# EasyEDA Pro project ProPrj_SCH_SnailCard底板_2025-01-03_23-10-43_2025-01-31.epro, board PCB_SnailCard 3底板
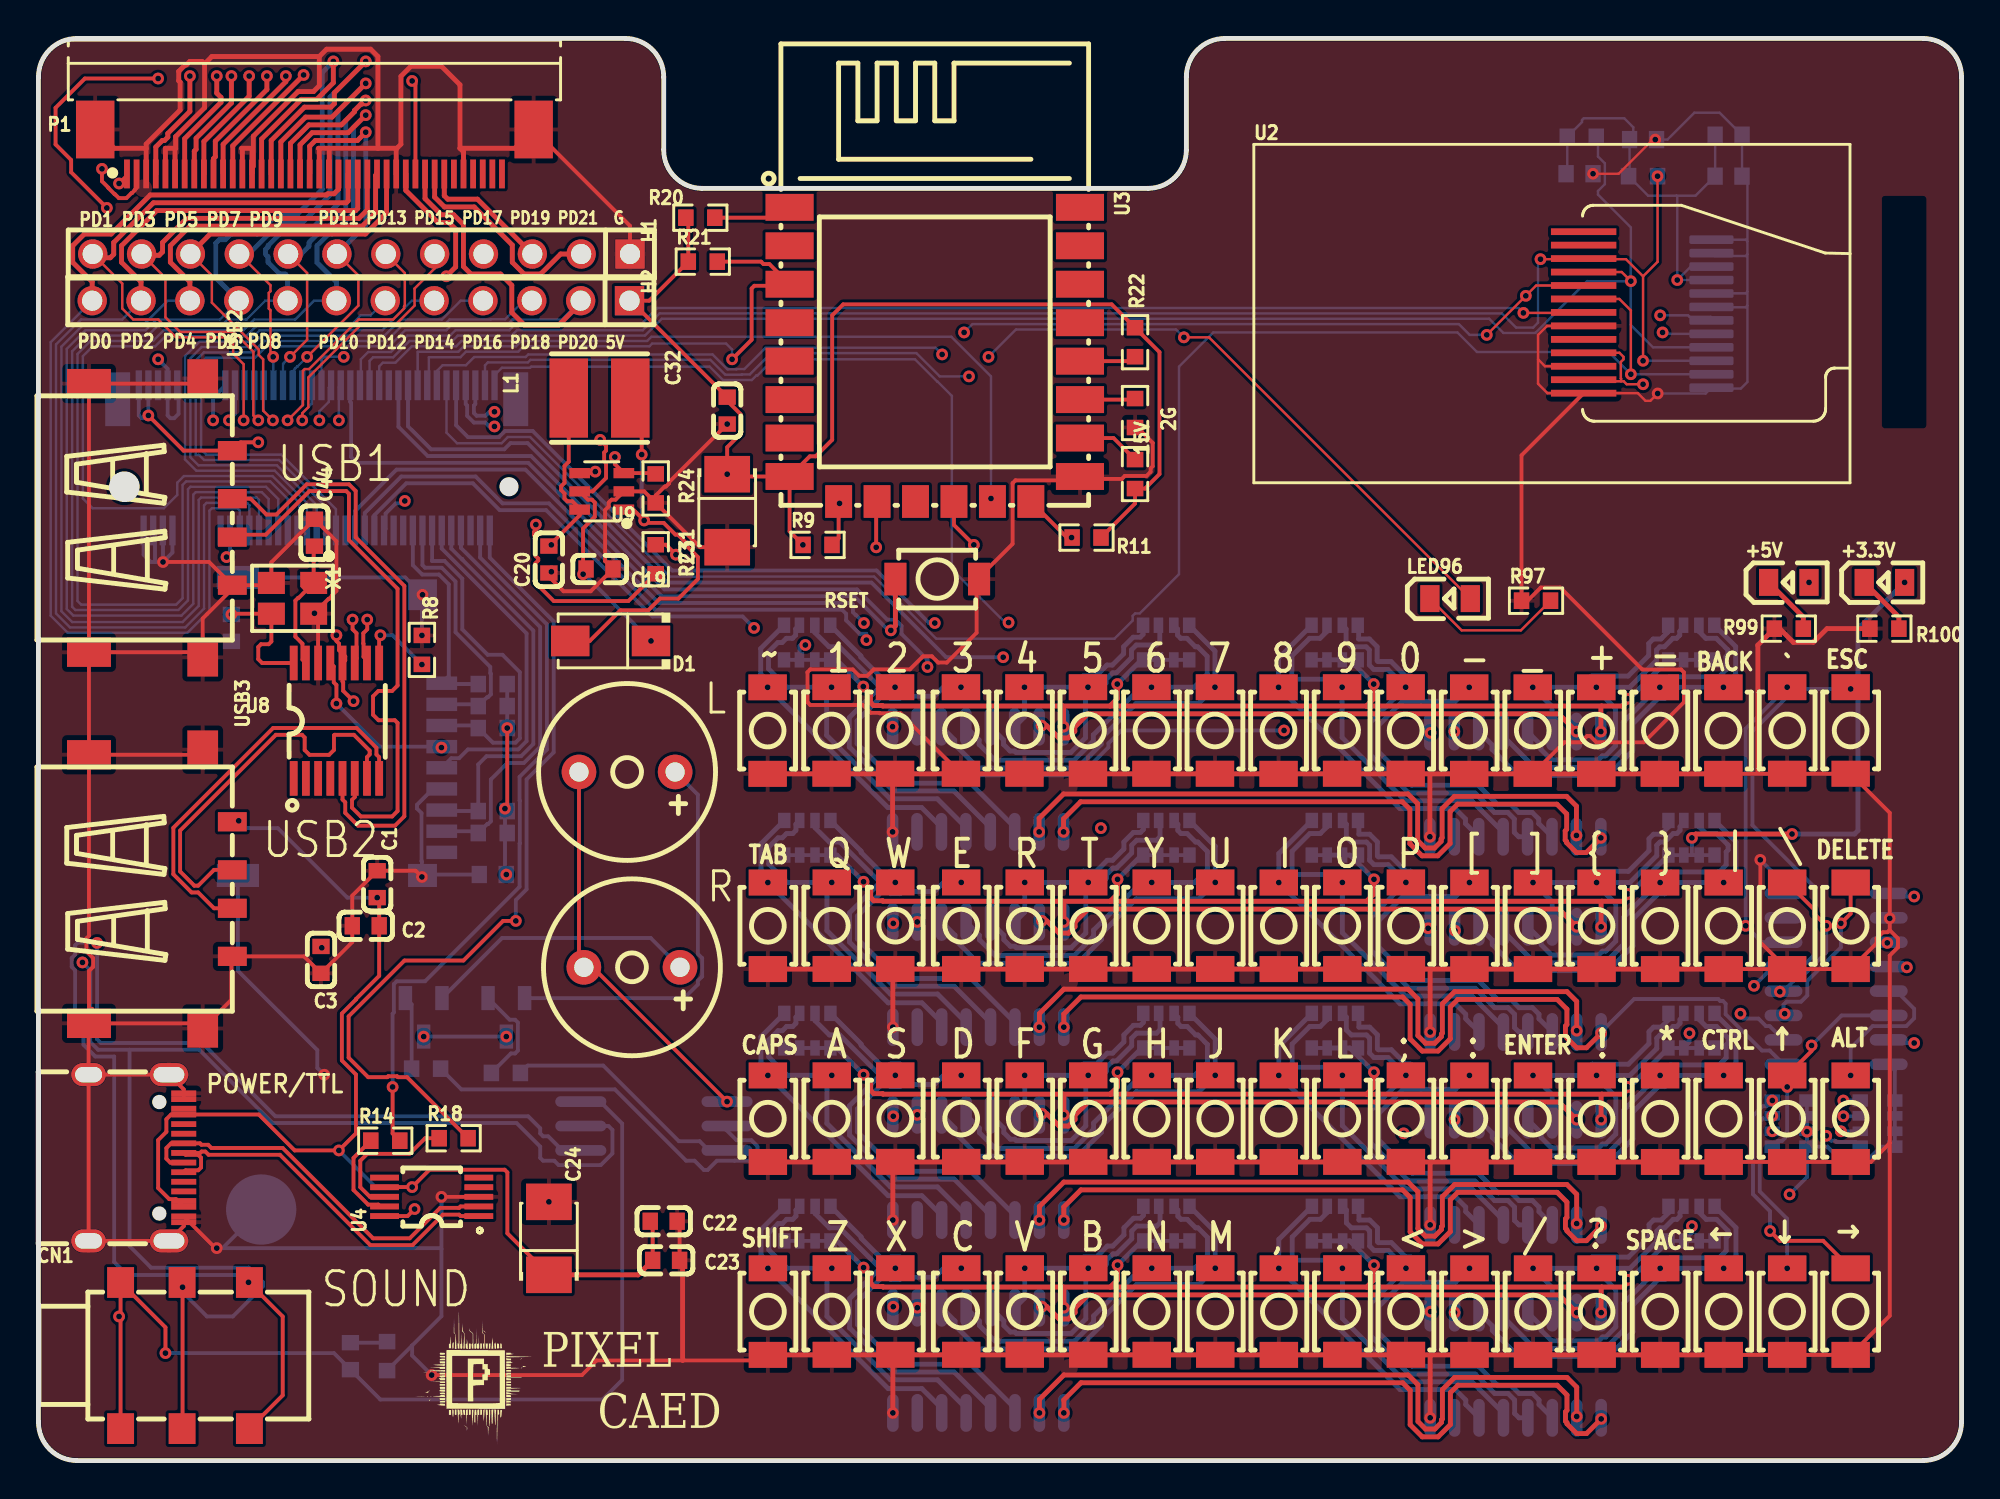
[diagram p1: board, top side]
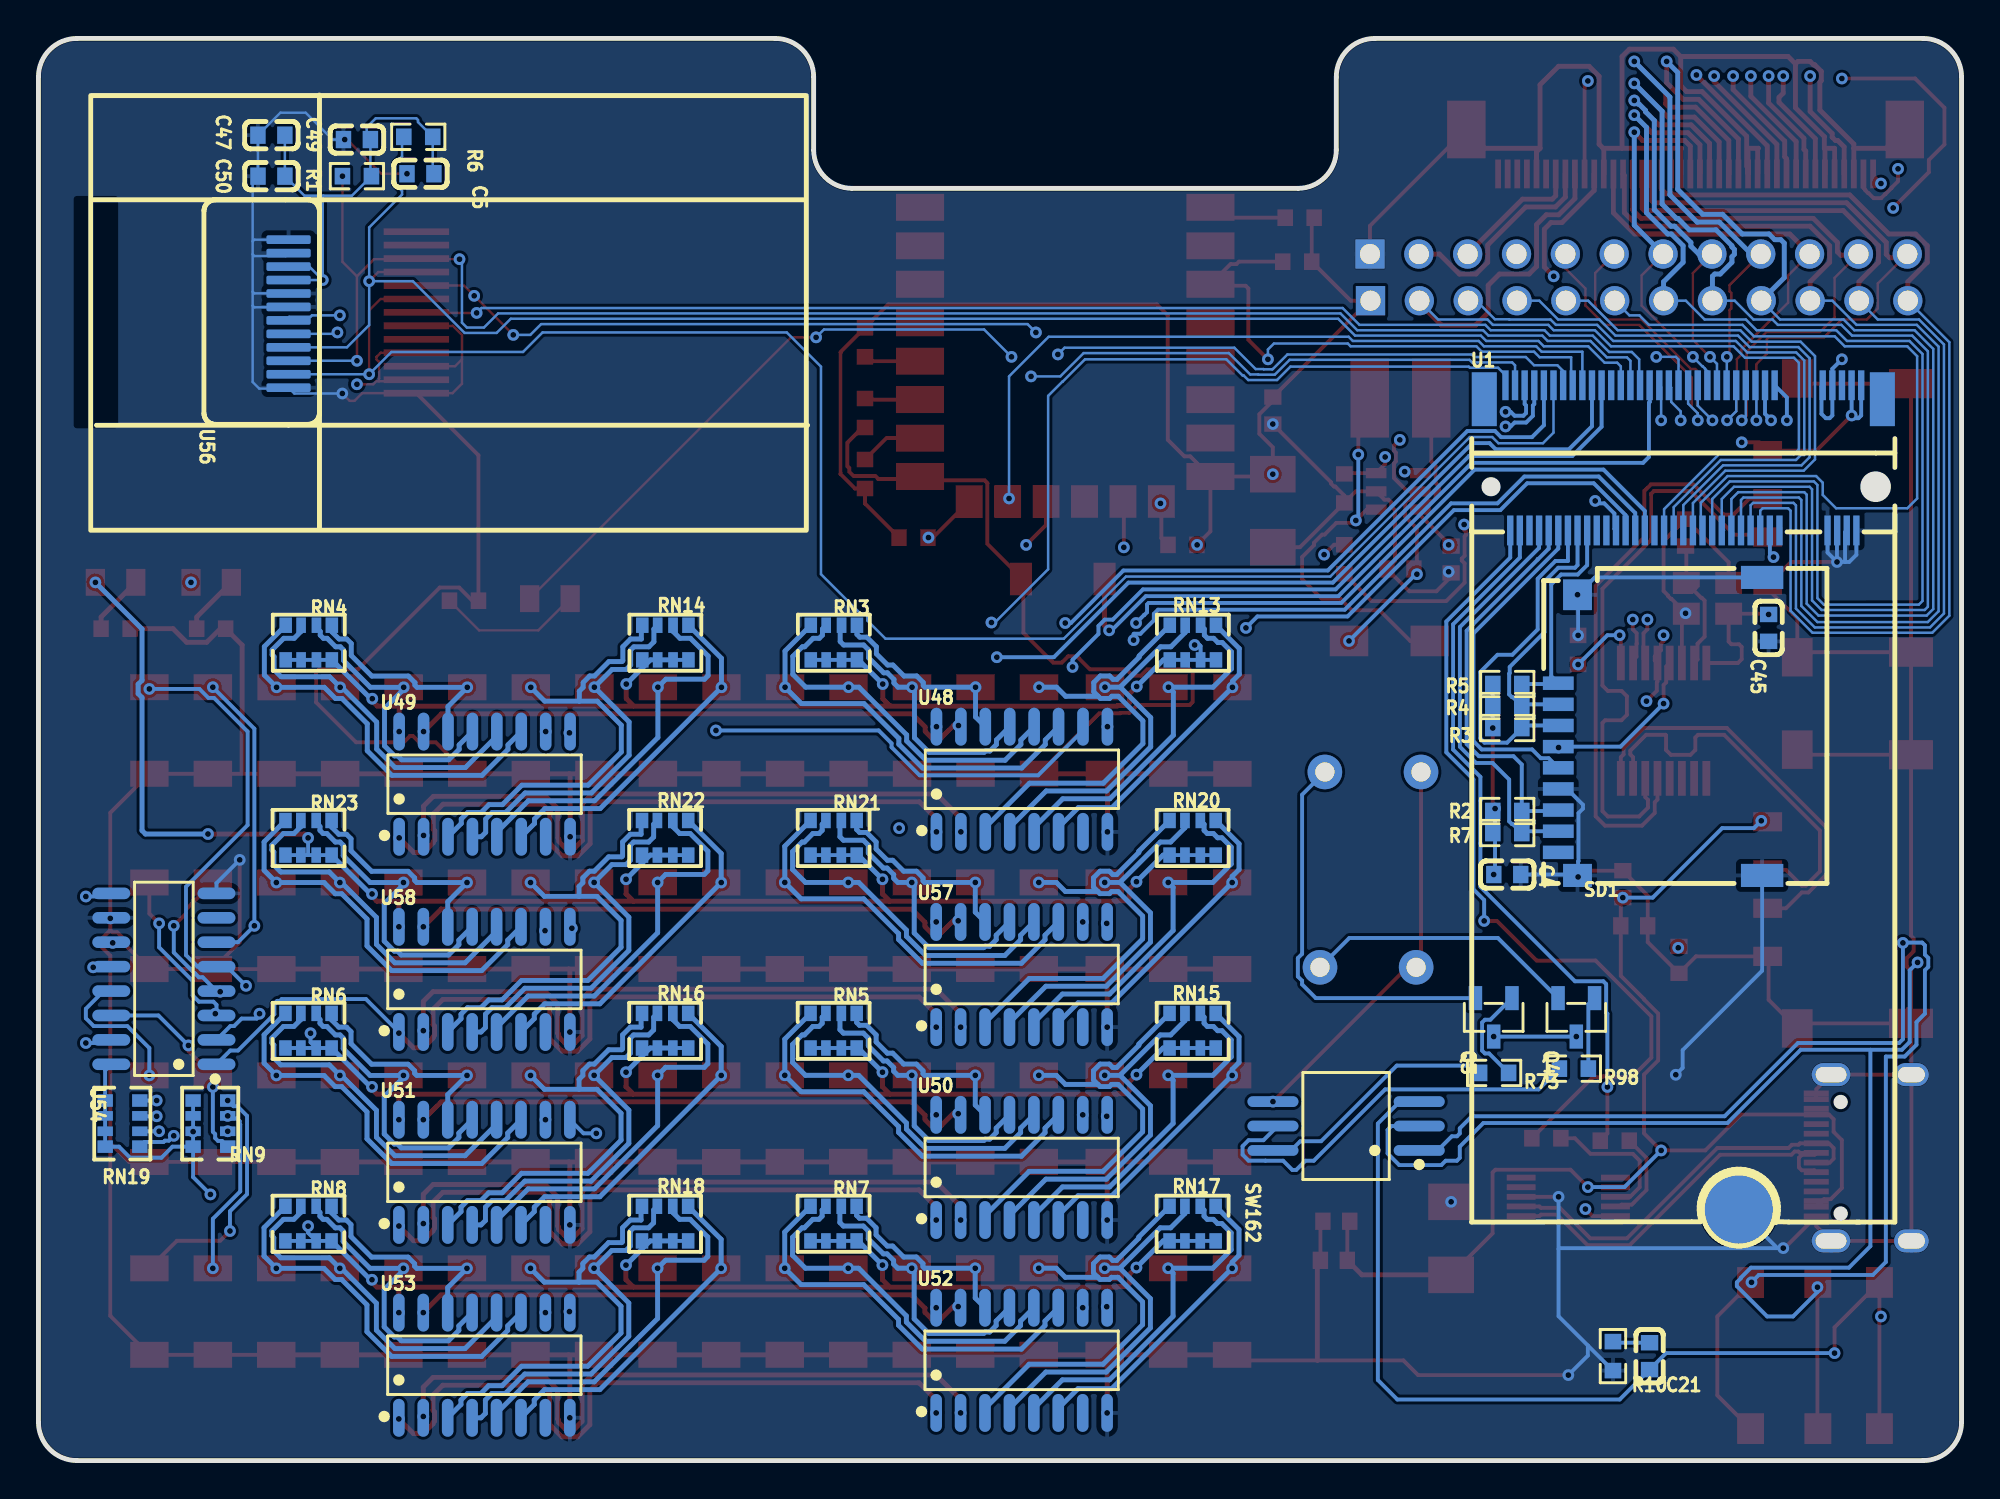
[diagram p2: board, bottom side, seen from below]

Outline 100 x 73.97 mm; copper layers: Top Layer, Inner1, Inner2, Bottom Layer. Coordinates in mm from the lower left corner of the outline.
Outline path: 0,71.97 arc(0.59,73.38) 2,73.97 30.51,73.97 arc(31.93,73.38) 32.51,71.97 32.51,68.17 arc(33.1,66.75) 34.51,66.17 57.69,66.17 arc(59.11,66.75) 59.69,68.17 59.69,71.97 arc(60.28,73.38) 61.69,73.97 98,73.97 arc(99.41,73.38) 100,71.97 100,2 arc(99.41,0.59) 98,0 2,0 arc(0.59,0.59) 0,2 0,71.97
Stack: Top Layer 0.035mm 外层铜厚1oz / Dielectric1 0.2104mm 7628 RC49% 8.6mil / Inner1 0.0152mm 内层铜厚 / Dielectric2 1.065mm 1.1mm H/HOZ Copper / Inner2 0.0152mm 内层铜厚 / Dielectric3 0.2104mm 7628 RC49% 8.6mil / Bottom Layer 0.035mm 外层铜厚1oz

## Design rules (mm)
net $1N98: DP2
net $1N97: DP2
net D-: DP3
net D+: DP3
net USB_P: DP1
net USB_N: DP1
net $1N102: DP5
net $1N101: DP5
net $1N100: DP4
net $1N99: DP4
template: 用户自定义配置
spacing Default (default): track to track 0.152, other pairs 0 to 0.152
track width Default (default): min 0.127, default 0.127, max 25.4
differential pair differentialPair (default): width min 0.127, default 0.254, max 2.54; gap min 0.152, default 0.152
via Default (default): diameter min 0.61, default 0.61, max 100.025; hole min 0.305, default 0.305, max 59.995

## Placement (name value [footprint] x y rotation side)
2G  10K  [R0603]  57.02 54.48 90 top
15V  10K  [R0603]  57.02 51.31 90 top
+3.3V  KT-0805G  [LED0805-R-RD]  95.99 45.67 0 top
+5V  KT-0805G  [LED0805-R-RD]  91.02 45.67 0 top
C1  10uF  [C0603]  17.61 29.98 270 top
C2  100nF  [C0603]  17.02 27.81 0 top
C3  10uF  [C0603]  14.69 26.04 270 top
C4  100nF  [C0603]  23.62 30.48 180 bottom
C5  4.7uF  [C0603]  80.14 66.93 0 bottom
C19  1uF  [C0603]  29.18 46.37 180 top
C20  10uF  [C0603]  26.54 46.86 90 top
C21  104  [C0603]  16.22 5.43 90 bottom
C22  100nF  [C0603]  32.51 12.45 0 top
C23  10uF  [C0603]  32.64 10.41 0 top
C24  1uF  [CAP-SMD_L3.5-W2.8-R-RD]  26.54 11.56 270 top
C31  100nF  [CAP-SMD_L3.5-W2.8-R-RD]  35.81 49.4 90 top
C32  10uF  [C0603]  35.81 54.61 270 top
C44  15pF  [C0603]  14.35 48.26 270 top
C45  15pF  [C0603]  10.03 43.31 90 bottom
C47  0.1uF  [C0603]  87.89 68.93 180 bottom
C49  0.1uF  [C0603]  83.44 68.71 180 bottom
C50  0.1uF  [C0603]  87.88 66.8 180 bottom
CN1  CK3.5-20-1  [AUDIO-SMD_CK3.5-20-1]  7.62 5.46 0 top
D1  -  [SMA_L4.3-W2.5-LS5.0-RD]  29.75 42.63 180 top
H1  -  [HDR-TH_12P-P2.54-V-M]  16.79 62.75 180 top
H2  -  [HDR-TH_12P-P2.54-V-M]  16.76 60.33 180 top
L  2.7kHz  [BUZ-TH_BD9.0-P5.00-D0.6-FD]  30.61 35.81 180 top
L1  22uH  [IND-SMD_L4.5-W4.0_SM4532]  29.18 55.26 0 top
LED96  KT-0805G  [LED0805-R-RD]  73.41 44.83 0 top
P1  AFC07-S40ECC-00  [CONN-SMD_AFC07-S40ECC-00]  14.35 68.07 0 top
POWER/TTL  TYPE-C-31-M-12  [USB-C_SMD-TYPE-C-31-M-12]  5.08 15.75 270 top
Q3  S8550  [SOT-23-3_L2.9-W1.3-P1.90-LS2.4-BR]  24.33 23.05 90 bottom
Q4  S8550  [SOT-23-3_L2.9-W1.3-P1.90-LS2.4-BR]  20.03 23.05 90 bottom
R  2.7kHz  [BUZ-TH_BD9.0-P5.00-D0.6-FD]  30.86 25.65 180 top
R1  10K  [R0603]  83.44 66.8 180 bottom
R2  10K  [R0603]  23.62 33.78 180 bottom
R3  10K  [R0603]  23.62 38.1 180 bottom
R4  10K  [R0603]  23.62 39.24 180 bottom
R5  10K  [R0603]  23.62 40.39 180 bottom
R6  10K  [R0603]  80.25 68.85 180 bottom
R7  10K  [R0603]  23.62 32.64 0 bottom
R8  2.2K  [R0603]  19.94 42.16 270 top
R9  10K  [R0603]  40.51 47.62 0 top
R10  22R  [R0603]  18.13 5.43 270 bottom
R11  10K  [R0603]  54.5 48.01 180 top
R14  470  [R0603]  18.03 16.64 0 top
R18  470  [R0603]  21.59 16.76 0 top
R20  10K  [R0603]  34.42 64.64 0 top
R21  10K  [R0603]  34.54 62.36 0 top
R22  10K  [R0603]  57.02 58.17 90 top
R23  10kΩ  [R0603]  32.1 46.88 90 top
R24  12Ω  [R0603]  32.1 50.56 90 top
R73  1kΩ  [R0603]  24.31 20.16 0 bottom
R97  330Ω  [R0603]  77.87 44.72 0 top
R98  1kΩ  [R0603]  20.16 20.38 0 bottom
R99  330Ω  [R0603]  91.02 43.27 0 top
R100  330Ω  [R0603]  95.99 43.27 0 top
RN3  10kΩ  [RES-ARRAY-SMD_0603-8P-L3.2-W1.6-BL]  58.64 42.55 0 bottom
RN4  10kΩ  [RES-ARRAY-SMD_0603-8P-L3.2-W1.6-BL]  85.94 42.55 0 bottom
RN5  10kΩ  [RES-ARRAY-SMD_0603-8P-L3.2-W1.6-BL]  58.65 22.36 0 bottom
RN6  10kΩ  [RES-ARRAY-SMD_0603-8P-L3.2-W1.6-BL]  85.96 22.36 0 bottom
RN7  10kΩ  [RES-ARRAY-SMD_0603-8P-L3.2-W1.6-BL]  58.65 12.32 0 bottom
RN8  10kΩ  [RES-ARRAY-SMD_0603-8P-L3.2-W1.6-BL]  85.96 12.32 0 bottom
RN9  10kΩ  [RES-ARRAY-SMD_0603-8P-L3.2-W1.6-BL]  91.06 17.53 90 bottom
RN13  10kΩ  [RES-ARRAY-SMD_0603-8P-L3.2-W1.6-BL]  39.97 42.55 0 bottom
RN14  10kΩ  [RES-ARRAY-SMD_0603-8P-L3.2-W1.6-BL]  67.4 42.55 0 bottom
RN15  10kΩ  [RES-ARRAY-SMD_0603-8P-L3.2-W1.6-BL]  39.98 22.36 0 bottom
RN16  10kΩ  [RES-ARRAY-SMD_0603-8P-L3.2-W1.6-BL]  67.41 22.36 0 bottom
RN17  10kΩ  [RES-ARRAY-SMD_0603-8P-L3.2-W1.6-BL]  39.99 12.32 0 bottom
RN18  10kΩ  [RES-ARRAY-SMD_0603-8P-L3.2-W1.6-BL]  67.42 12.32 0 bottom
RN19  10kΩ  [RES-ARRAY-SMD_0603-8P-L3.2-W1.6-BL]  95.63 17.53 90 bottom
RN20  10kΩ  [RES-ARRAY-SMD_0603-8P-L3.2-W1.6-BL]  39.98 32.39 0 bottom
RN21  10kΩ  [RES-ARRAY-SMD_0603-8P-L3.2-W1.6-BL]  58.65 32.39 0 bottom
RN22  10kΩ  [RES-ARRAY-SMD_0603-8P-L3.2-W1.6-BL]  67.41 32.39 0 bottom
RN23  10kΩ  [RES-ARRAY-SMD_0603-8P-L3.2-W1.6-BL]  85.96 32.39 0 bottom
RSET  ST-1185S  [SW-SMD_ST-1185S]  46.74 45.85 0 top
SD1  SD  [TF-SMD_TF-115K]  15.67 38.18 90 bottom
SW90  -  [SW-SMD_L3.9-W2.9-P4.15-LS5.0]  37.92 37.97 90 top
SW91  -  [SW-SMD_L3.9-W2.9-P4.15-LS5.0]  41.24 37.97 90 top
SW92  -  [SW-SMD_L3.9-W2.9-P4.15-LS5.0]  44.54 37.97 90 top
SW93  -  [SW-SMD_L3.9-W2.9-P4.15-LS5.0]  47.97 37.97 90 top
SW94  -  [SW-SMD_L3.9-W2.9-P4.15-LS5.0]  51.27 37.97 90 top
SW95  -  [SW-SMD_L3.9-W2.9-P4.15-LS5.0]  54.57 37.97 90 top
SW96  -  [SW-SMD_L3.9-W2.9-P4.15-LS5.0]  57.88 37.97 90 top
SW97  -  [SW-SMD_L3.9-W2.9-P4.15-LS5.0]  61.18 37.97 90 top
SW98  -  [SW-SMD_L3.9-W2.9-P4.15-LS5.0]  64.48 37.97 90 top
SW99  -  [SW-SMD_L3.9-W2.9-P4.15-LS5.0]  67.79 37.97 90 top
SW100  -  [SW-SMD_L3.9-W2.9-P4.15-LS5.0]  71.09 37.97 90 top
SW101  -  [SW-SMD_L3.9-W2.9-P4.15-LS5.0]  74.4 37.97 90 top
SW102  -  [SW-SMD_L3.9-W2.9-P4.15-LS5.0]  77.7 37.97 90 top
SW103  -  [SW-SMD_L3.9-W2.9-P4.15-LS5.0]  81.01 37.97 90 top
SW104  -  [SW-SMD_L3.9-W2.9-P4.15-LS5.0]  84.31 37.97 90 top
SW105  -  [SW-SMD_L3.9-W2.9-P4.15-LS5.0]  87.62 37.97 90 top
SW106  -  [SW-SMD_L3.9-W2.9-P4.15-LS5.0]  37.93 17.78 90 top
SW107  -  [SW-SMD_L3.9-W2.9-P4.15-LS5.0]  41.25 17.79 90 top
SW108  -  [SW-SMD_L3.9-W2.9-P4.15-LS5.0]  44.55 17.79 90 top
SW109  -  [SW-SMD_L3.9-W2.9-P4.15-LS5.0]  47.98 17.79 90 top
SW110  -  [SW-SMD_L3.9-W2.9-P4.15-LS5.0]  51.29 17.79 90 top
SW111  -  [SW-SMD_L3.9-W2.9-P4.15-LS5.0]  54.59 17.79 90 top
SW112  -  [SW-SMD_L3.9-W2.9-P4.15-LS5.0]  57.89 17.79 90 top
SW113  -  [SW-SMD_L3.9-W2.9-P4.15-LS5.0]  61.19 17.79 90 top
SW114  -  [SW-SMD_L3.9-W2.9-P4.15-LS5.0]  64.5 17.78 90 top
SW115  -  [SW-SMD_L3.9-W2.9-P4.15-LS5.0]  67.8 17.79 90 top
SW116  -  [SW-SMD_L3.9-W2.9-P4.15-LS5.0]  71.11 17.79 90 top
SW117  -  [SW-SMD_L3.9-W2.9-P4.15-LS5.0]  74.41 17.78 90 top
SW118  -  [SW-SMD_L3.9-W2.9-P4.15-LS5.0]  77.72 17.78 90 top
SW119  -  [SW-SMD_L3.9-W2.9-P4.15-LS5.0]  81.02 17.78 90 top
SW120  -  [SW-SMD_L3.9-W2.9-P4.15-LS5.0]  84.33 17.78 90 top
SW121  -  [SW-SMD_L3.9-W2.9-P4.15-LS5.0]  87.63 17.78 90 top
SW122  -  [SW-SMD_L3.9-W2.9-P4.15-LS5.0]  37.93 7.75 90 top
SW123  -  [SW-SMD_L3.9-W2.9-P4.15-LS5.0]  41.25 7.75 90 top
SW124  -  [SW-SMD_L3.9-W2.9-P4.15-LS5.0]  44.56 7.75 90 top
SW125  -  [SW-SMD_L3.9-W2.9-P4.15-LS5.0]  47.99 7.75 90 top
SW126  -  [SW-SMD_L3.9-W2.9-P4.15-LS5.0]  51.29 7.75 90 top
SW127  -  [SW-SMD_L3.9-W2.9-P4.15-LS5.0]  54.59 7.75 90 top
SW128  -  [SW-SMD_L3.9-W2.9-P4.15-LS5.0]  57.89 7.75 90 top
SW129  -  [SW-SMD_L3.9-W2.9-P4.15-LS5.0]  61.19 7.75 90 top
SW130  -  [SW-SMD_L3.9-W2.9-P4.15-LS5.0]  64.5 7.75 90 top
SW131  -  [SW-SMD_L3.9-W2.9-P4.15-LS5.0]  67.8 7.75 90 top
SW132  -  [SW-SMD_L3.9-W2.9-P4.15-LS5.0]  71.11 7.75 90 top
SW133  -  [SW-SMD_L3.9-W2.9-P4.15-LS5.0]  74.41 7.75 90 top
SW134  -  [SW-SMD_L3.9-W2.9-P4.15-LS5.0]  77.72 7.75 90 top
SW135  -  [SW-SMD_L3.9-W2.9-P4.15-LS5.0]  81.02 7.75 90 top
SW136  -  [SW-SMD_L3.9-W2.9-P4.15-LS5.0]  84.33 7.75 90 top
SW137  -  [SW-SMD_L3.9-W2.9-P4.15-LS5.0]  87.63 7.75 90 top
SW138  -  [SW-SMD_L3.9-W2.9-P4.15-LS5.0]  90.93 37.97 90 top
SW139  -  [SW-SMD_L3.9-W2.9-P4.15-LS5.0]  94.23 37.97 90 top
SW140  -  [SW-SMD_L3.9-W2.9-P4.15-LS5.0]  90.93 27.81 90 top
SW141  -  [SW-SMD_L3.9-W2.9-P4.15-LS5.0]  94.23 27.81 90 top
SW142  -  [SW-SMD_L3.9-W2.9-P4.15-LS5.0]  90.93 17.78 90 top
SW143  -  [SW-SMD_L3.9-W2.9-P4.15-LS5.0]  94.23 17.78 90 top
SW144  -  [SW-SMD_L3.9-W2.9-P4.15-LS5.0]  90.93 7.75 90 top
SW145  -  [SW-SMD_L3.9-W2.9-P4.15-LS5.0]  94.23 7.75 90 top
SW146  -  [SW-SMD_L3.9-W2.9-P4.15-LS5.0]  37.93 27.81 90 top
SW147  -  [SW-SMD_L3.9-W2.9-P4.15-LS5.0]  41.25 27.82 90 top
SW148  -  [SW-SMD_L3.9-W2.9-P4.15-LS5.0]  44.55 27.82 90 top
SW149  -  [SW-SMD_L3.9-W2.9-P4.15-LS5.0]  47.98 27.82 90 top
SW150  -  [SW-SMD_L3.9-W2.9-P4.15-LS5.0]  51.29 27.82 90 top
SW151  -  [SW-SMD_L3.9-W2.9-P4.15-LS5.0]  54.59 27.82 90 top
SW152  -  [SW-SMD_L3.9-W2.9-P4.15-LS5.0]  57.89 27.82 90 top
SW153  -  [SW-SMD_L3.9-W2.9-P4.15-LS5.0]  61.19 27.82 90 top
SW154  -  [SW-SMD_L3.9-W2.9-P4.15-LS5.0]  64.5 27.81 90 top
SW155  -  [SW-SMD_L3.9-W2.9-P4.15-LS5.0]  67.8 27.82 90 top
SW156  -  [SW-SMD_L3.9-W2.9-P4.15-LS5.0]  71.11 27.82 90 top
SW157  -  [SW-SMD_L3.9-W2.9-P4.15-LS5.0]  74.41 27.81 90 top
SW158  -  [SW-SMD_L3.9-W2.9-P4.15-LS5.0]  77.72 27.81 90 top
SW159  -  [SW-SMD_L3.9-W2.9-P4.15-LS5.0]  81.02 27.81 90 top
SW160  -  [SW-SMD_L3.9-W2.9-P4.15-LS5.0]  84.33 27.81 90 top
SW161  -  [SW-SMD_L3.9-W2.9-P4.15-LS5.0]  87.63 27.81 90 top
SW162  DSHP03TS-S  [SW-SMD_DSHP03TS-S]  32 17.4 90 bottom
U1  -  [SNAIL_CORE2]  14.48 33.4 180 bottom
U2  1.14IPS-TFT  [1.14IPS]  78.52 59.78 0 top
U3  ESP-12F  [WIFIM-SMD_ESP-12F-ESP8266MOD]  46.61 57.53 270 top
U4  CH340E  [MSOP-10_L3.0-W3.0-P0.50-LS5.0-BL]  20.45 13.72 90 top
U8  FE8.1  [SSOP-16_L4.9-W3.9-P0.64-LS6.0-BL]  15.49 38.48 0 top
U9  RY3730  [SOT-23-6_L2.9-W1.6-P0.95-LS2.8-BL]  29.29 50.41 90 top
U48  -  [SOIC-16_L9.9-W3.9-P1.27-LS6.0-BL]  48.86 35.43 180 bottom
U49  -  [SOIC-16_L9.9-W3.9-P1.27-LS6.0-BL]  76.8 35.18 180 bottom
U50  -  [SOIC-16_L9.9-W3.9-P1.27-LS6.0-BL]  48.87 15.25 180 bottom
U51  -  [SOIC-16_L9.9-W3.9-P1.27-LS6.0-BL]  76.81 14.99 180 bottom
U52  -  [SOIC-16_L9.9-W3.9-P1.27-LS6.0-BL]  48.88 5.21 180 bottom
U53  -  [SOIC-16_L9.9-W3.9-P1.27-LS6.0-BL]  76.81 4.96 180 bottom
U54  -  [SOIC-16_L9.9-W3.9-P1.27-LS6.0-BL]  93.48 25.05 90 bottom
U56  -  [1.47''173*320 ST7789]  87 63.5 90 bottom
U57  -  [SOIC-16_L9.9-W3.9-P1.27-LS6.0-BL]  48.87 25.28 180 bottom
U58  -  [SOIC-16_L9.9-W3.9-P1.27-LS6.0-BL]  76.81 25.02 180 bottom
USB2  -  [USB-A]  6.31 49.03 270 top
USB3  -  [USB-A]  6.31 29.72 270 top
X1  12MHz  [OSC-SMD_4P-L3.2-W2.5-BL]  13.21 44.85 180 top

## Footprints (pads in the part's own frame, mm; a bottom-side part is the same pattern mirrored in y, then rotated)
1.14IPS
  rect 3.4x0.35 smd: 1(1.828,4.132) 2(1.828,3.432) 3(1.828,2.732) 4(1.828,2.032) 5(1.828,1.332) 6(1.828,0.632) 7(1.828,-0.068) 8(1.828,-0.768) 9(1.828,-1.468) 10(1.828,-2.168) 11(1.828,-2.868) 12(1.828,-3.568) 13(1.828,-4.268)
1.47''173*320 ST7789
  rrect 0.45x2.3 smd: 1(0,0) 2(-0.7,0) 3(-1.4,0) 4(-2.1,0) 5(-2.8,0) 6(-3.5,0) 7(-4.2,0) 8(-4.9,0) 9(-5.6,0) 10(-6.3,0) 11(-7,0) 12(-7.7,0)
AUDIO-SMD_CK3.5-20-1
  rect 1.4x1.6 smd: 1(-3.35,3.8) 1(-3.35,-3.8) 2(-0.15,3.8) 2(-0.15,-3.8) 3(3.35,3.8) 3(3.35,-3.8)
BUZ-TH_BD9.0-P5.00-D0.6-FD
  round 1.8 hole 1: 1(-2.5,0) 2(2.5,0)
C0603
  rect 0.8x0.9 smd: 1(-0.7,0) 2(0.7,0)
CAP-SMD_L3.5-W2.8-R-RD
  rect 1.9x2.376 smd: 1(1.899,0) 2(-1.899,0)
CONN-SMD_AFC07-S40ECC-00
  rect 0.3x1.5 smd: 1(-9.75,-1.153) 2(-9.249,-1.153) 3(-8.749,-1.153) 4(-8.249,-1.153) 5(-7.75,-1.153) 6(-7.249,-1.153) 7(-6.749,-1.153) 8(-6.249,-1.153) 9(-5.749,-1.153) 10(-5.248,-1.153) 11(-4.748,-1.153) 12(-4.248,-1.153) 13(-3.748,-1.153) 14(-3.248,-1.153) 15(-2.748,-1.155) 16(-2.248,-1.154) 17(-1.748,-1.153) 18(-1.248,-1.153) 19(-0.748,-1.153) 20(-0.248,-1.157) 21(0.252,-1.157) 22(0.751,-1.157) 23(1.252,-1.157) 24(1.752,-1.157) 25(2.252,-1.157) 26(2.752,-1.157) 27(3.252,-1.157) 28(3.752,-1.157) 29(4.252,-1.157) 30(4.751,-1.157) 31(5.251,-1.157) 32(5.751,-1.157) 33(6.25,-1.157) 34(6.751,-1.157) 35(7.25,-1.157) 36(7.75,-1.153) 37(8.251,-1.153) 38(8.75,-1.153) 39(9.25,-1.153) 40(9.75,-1.153)
  rect 2x3 smd: 41(11.4,1.157) 42(-11.4,1.157)
HDR-TH_12P-P2.54-V-M
  rect 1.524x1.524 hole 1.05: 1(-13.97,0)
  round 1.524 hole 1.05: 2(-11.43,0) 3(-8.89,0) 4(-6.35,0) 5(-3.81,0) 6(-1.27,0) 7(1.27,0) 8(3.81,0) 9(6.35,0) 10(8.89,0) 11(11.43,0) 12(13.97,0)
IND-SMD_L4.5-W4.0_SM4532
  rect 2x4.12 smd: 1(1.6,0) 2(-1.6,0)
LED0805-R-RD
  rect 1x1.399 smd: 1(1.05,0) 2(-1.05,0)
MSOP-10_L3.0-W3.0-P0.50-LS5.0-BL
  rect 0.305x1.5 smd: 1(-1,-2.451) 2(-0.5,-2.451) 3(0,-2.451) 4(0.5,-2.451) 5(1,-2.451) 6(1,2.451) 7(0.5,2.451) 8(0,2.451) 9(-0.5,2.451) 10(-1,2.451)
OSC-SMD_4P-L3.2-W2.5-BL
  custom 1.4x1.15 smd: 1(-1.1,-0.8)
  rect 1.4x1.15 smd: 2(1.1,-0.8) 3(1.1,0.8) 4(-1.1,0.8)
R0603
  rect 0.806x0.864 smd: 1(-0.753,0) 2(0.753,0)
RES-ARRAY-SMD_0603-8P-L3.2-W1.6-BL
  rect 0.65x0.8 smd: 1(-1.2,-0.9) 4(1.2,-0.9) 5(1.2,0.9) 8(-1.2,0.9)
  rect 0.5x0.8 smd: 2(-0.4,-0.9) 3(0.4,-0.9) 6(0.4,0.9) 7(-0.4,0.9)
SMA_L4.3-W2.5-LS5.0-RD
  rect 2x1.593 smd: 1(-2.1,0) 2(2.1,0)
SNAIL_CORE2
  rect 0.33x1.55 smd: 1(-9.239,22.525) 2(-8.989,14.975) 3(-8.74,22.525) 4(-8.49,14.975) 5(-8.239,22.525) 6(-7.989,14.975) 7(-7.74,22.525) 8(-7.49,14.975) 9(-7.239,22.525) 10(-6.989,14.975) 11(-6.74,22.525) 12(-6.49,14.975) 13(-6.239,22.525) 14(-5.99,14.975) 15(-5.74,22.525) 16(-5.49,14.975) 17(-5.239,22.525) 18(-4.99,14.975) 19(-4.74,22.525) 20(-4.49,14.975) 21(-4.239,22.525) 22(-3.99,14.975) 23(-3.74,22.525) 24(-3.49,14.975) 25(-3.24,22.525) 26(-2.99,14.975) 27(-2.74,22.525) 28(-2.49,14.975) 29(-2.24,22.525) 30(-1.99,14.975) 31(-1.74,22.525) 32(-1.49,14.975) 33(-1.24,22.525) 34(-0.99,14.975) 35(-0.74,22.525) 36(-0.49,14.975) 37(-0.239,22.525) 38(0.01,14.975) 39(0.26,22.525) 40(0.51,14.975) 41(0.76,22.525) 42(1.01,14.975) 43(1.26,22.525) 44(1.51,14.975) 45(1.76,22.525) 46(2.01,14.975) 47(2.26,22.525) 48(2.51,14.975) 49(2.76,22.525) 50(3.01,14.975) 51(3.26,22.525) 52(3.51,14.975) 53(3.76,22.525) 54(4.01,14.975) 55(4.26,22.525) 56(4.511,14.975) 57(4.761,22.525) 58(5.01,14.975) 67(7.26,22.525) 68(7.511,14.975) 69(7.761,22.525) 70(8.01,14.975) 71(8.26,22.525) 72(8.511,14.975) 73(8.761,22.525) 74(9.01,14.975) 75(9.26,22.525)
  rect 1.3x2.8 smd: 76(10.36,21.8) 77(-10.34,21.8)
  custom 3.654x3.654 smd: 78(2.896,-20.346)
SOIC-16_L9.9-W3.9-P1.27-LS6.0-BL
  oval 0.602x1.971 smd: 1(-4.445,-2.736) 2(-3.175,-2.736) 3(-1.905,-2.736) 4(-0.635,-2.736) 5(0.635,-2.736) 6(1.905,-2.736) 7(3.175,-2.736) 8(4.445,-2.736) 9(4.445,2.736) 10(3.175,2.736) 11(1.905,2.736) 12(0.635,2.736) 13(-0.635,2.736) 14(-1.905,2.736) 15(-3.175,2.736) 16(-4.445,2.736)
SOT-23-3_L2.9-W1.3-P1.90-LS2.4-BR
  rect 1.25x0.7 smd: 1(1,-0.95) 2(1,0.95) 3(-1,0)
SOT-23-6_L2.9-W1.6-P0.95-LS2.8-BL
  rect 0.532x1.072 smd: 1(-0.95,-1.149) 2(0,-1.149) 3(0.95,-1.149) 4(0.95,1.149) 5(0,1.149) 6(-0.95,1.149)
SSOP-16_L4.9-W3.9-P0.64-LS6.0-BL
  rect 0.406x1.804 smd: 1(-2.223,-3) 2(-1.587,-3) 3(-0.953,-3) 4(-0.318,-3) 5(0.318,-3) 6(0.953,-3) 7(1.587,-3) 8(2.223,-3) 9(2.223,3) 10(1.587,3) 11(0.953,3) 12(0.318,3) 13(-0.318,3) 14(-0.953,3) 15(-1.587,3) 16(-2.223,3)
SW-SMD_DSHP03TS-S
  oval 0.56x2.655 smd: 1(-1.27,-3.803) 2(0,-3.803) 3(1.27,-3.803) 4(1.27,3.803) 5(0,3.803) 6(-1.27,3.803)
SW-SMD_L3.9-W2.9-P4.15-LS5.0
  rect 1.351x1.999 smd: 1(-2.251,0) 2(2.251,0)
SW-SMD_ST-1185S
  rect 1.15x1.7 smd: 1(-2.175,0) 2(2.175,0)
TF-SMD_TF-115K
  rect 0.7x1.6 smd: 1(2.25,5.3) 2(1.15,5.3) 3(0.05,5.3) 4(-1.05,5.3) 5(-2.15,5.3) 6(-3.25,5.3) 7(-4.35,5.3) 8(-5.45,5.3) 9(-6.55,5.3)
  rect 1.2x2.2 smd: 10(-7.75,-5.3) 10(7.75,-5.3)
  rect 1.2x1.5 smd: 10(-7.75,4.3)
  rect 1.6x1.5 smd: 10(6.85,4.3)
USB-A
  rect 1x1.5 smd: 1(-3.5,3.77) 2(-1,3.77) 3(1,3.77) 4(3.5,3.77)
  custom 1.524x2.286 smd: 5(-6.985,-3.683) 6(6.985,-3.683)
  rect 2x1.6 smd: 7(-7.25,2.23) 8(7.25,2.23)
USB-C_SMD-TYPE-C-31-M-12
  oval 1.2x2 hole 0.8x1.6: 0(-4.325,1.706) 0(4.325,1.706)
  oval 1.2x1.8 hole 0.8x1.4: 0(-4.325,-2.474) 0(4.325,-2.474)
  rect 0.3x1.3 smd: A1(-3.35,2.474) A4(-2.55,2.474) A5(-1.25,2.474) A6(-0.25,2.474) A7(0.25,2.474) A8(1.25,2.474) A9(2.55,2.474) A12(3.35,2.474) B1(3.05,2.474) B4(2.25,2.474) B5(1.75,2.474) B6(0.75,2.474) B7(-0.75,2.474) B8(-1.75,2.474) B9(-2.25,2.474) B12(-3.05,2.474)
WIFIM-SMD_ESP-12F-ESP8266MOD
  rect 1.4x2.5 smd: 1(-7.651,-7.551) 2(-5.651,-7.551) 3(-3.651,-7.551) 4(-1.651,-7.551) 5(0.349,-7.551) 6(2.349,-7.551) 7(4.349,-7.551) 8(6.349,-7.551) 9(6.349,7.548) 10(4.349,7.55) 11(2.349,7.551) 12(0.349,7.551) 13(-1.651,7.55) 14(-3.651,7.551) 15(-5.651,7.551) 16(-7.651,7.551)
  rect 1.7x1.4 smd: 17(7.651,-5) 18(7.649,-3.002) 19(7.649,-1.004) 20(7.649,0.998) 21(7.649,2.997) 22(7.651,4.997)

## Nets
As in the schematic, except:
+3V3: 15V.1 +3.3V.1 C3.1 C4.1 C5.1 C31.1 C32.1 C47.2 C49.2 C50.2 H2.1 P1.4 P1.31 Q3.3 Q4.3 R1.2 R2.1 R3.1 R4.1 R5.1 R6.2 R7.2 R9.1 R11.1 R20.1 R21.1 R22.2 R23.2 RN3.5 RN3.6 RN3.7 RN3.8 RN4.5 RN4.6 RN4.7 RN4.8 RN5.5 RN5.6 RN5.7 RN5.8 RN6.5 RN6.6 RN6.7 RN6.8 RN7.5 RN7.6 RN7.7 RN7.8 RN8.5 RN8.6 RN8.7 RN8.8 RN9.5 RN9.6 RN9.7 RN9.8 RN13.5 RN13.6 RN13.7 RN13.8 RN14.5 RN14.6 RN14.7 RN14.8 RN15.5 RN15.6 RN15.7 RN15.8 RN16.5 RN16.6 RN16.7 RN16.8 RN17.5 RN17.6 RN17.7 RN17.8 RN18.5 RN18.6 RN18.7 RN18.8 RN19.5 RN19.6 RN19.7 RN19.8 RN20.5 RN20.6 RN20.7 RN20.8 RN21.5 RN21.6 RN21.7 RN21.8 RN22.5 RN22.6 RN22.7 RN22.8 RN23.5 RN23.6 RN23.7 RN23.8 SD1.4 U1.67 U1.69 U2.10 U2.12 U3.8 U4.10 U8.13 U48.16 U49.16 U50.16 U51.16 U52.16 U53.16 U54.16 U56.3 U56.4 U57.16 U58.16
+5V: +5V.1 C1.2 C2.2 C20.2 C22.1 C23.1 C24.1 L1.2 POWER/TTL.A4 POWER/TTL.A9 POWER/TTL.B4 POWER/TTL.B9 U1.73 U1.75 U4.7 U8.12 U9.6 USB2.1 USB3.1
$1N14855: L.1 Q3.2
$1N15049: Q4.2 R.1
$1N15070: L.2 R.2 SW162.4
$1N30881: +5V.2 R99.2
$1N30981: +3.3V.2 R100.2

Pads without a net: P1 35 37 38 39 40; POWER/TTL A5 A8 B5 B8; SD1 9; U1 6 20 22 23 32 58 71 76 77; U2 1 2 9; U3 2 4 5 6 7 13 14 15 16 19; U4 4 5 6; U8 1 2 3 4; U48 7; U49 7; U50 7; U51 7; U52 7; U53 7; U54 7; U57 7; U58 7

## Via types
v1: diameter 0.61, hole 0.305, Top Layer to Bottom Layer, 299 vias

## Routing (per net, layer and track width the routed paths; a pad name or vN(x,y) marks a point on that pad's centre or on a via; arc(x,y) is an arc through that point)
+3V3: length 612.7
  Top Layer w0.127: U2.10 82.21,57.62 82.42,57.4 82.42,57.28 82.28,57.14 82.28,56.28 82.3,56.27 82.3,56.13 ; 82.3,56.13 82.43,56.13 82.59,55.98 v1(83.44,55.98) ; 82.3,56.13 80.43,56.13 U2.12
  Top Layer w0.2: R23.2 32.63,47.63 v1(33.15,47.12) ; 30.8,60.33 H2.1 ; 30.8,60.33 C32.1 35.81,55.12 36.52,54.41 36.52,53.41 35.81,52.7 v1(35.81,51.3) 35.93,51.18 U3.8 ; 30.8,60.33 31.76,60.33 R21.1 33.79,64.52 R20.1 ; v1(39.75,47.62) R9.1 39.06,48.33 U3.8 ; U3.8 40.11,52.23 40.41,52.23 41.28,53.09 41.28,59.56 41.85,60.13 55.81,60.13 R22.2 58.29,57.65 58.29,51.31 57.54,50.55 15V.1 57.02,49.78 R11.1 ; P1.31 19.6,71.58 v1(19.43,71.76) ; v1(6.22,71.88) 2.41,71.88 0.89,70.36 0.89,68.45 1.7,67.64 1.7,67.01 v1(3.56,65.15) ; v1(24.38,38.1) 24.38,34.03 v1(24.26,33.91) ; v1(19.56,13.08) 19.19,12.72 U4.10 ; U8.13 15.36,41.3 15.36,40.48 15.49,40.34 v1(15.49,39.37) ; C3.1 14.69,26.71 v1(14.73,26.67)
  Top Layer w0.254: 55.73,19.06 69.07,19.06 ; 55.73,19.06 53.29,19.06 ; 55.73,19.06 56.11,19.44 v1(56.11,20.2) ; 69.07,19.06 69.45,19.44 v1(69.45,20.2) ; 69.07,19.06 81.29,19.06 ; 53.28,39.24 53.3,39.21 v1(53.3,38.17) ; 53.28,39.24 43.91,39.24 43.88,39.27 43.43,39.27 43.26,39.43 43.26,39.89 v1(42.89,40.26) ; 53.28,39.24 55.72,39.24 ; 55.73,9.02 56.11,9.4 v1(56.11,10.17) ; 55.73,9.02 53.29,9.02 ; 55.73,9.02 69.07,9.02 ; 53.29,29.09 43.92,29.09 43.89,29.11 43.44,29.11 43.28,29.28 43.28,29.73 v1(42.9,30.1) ; 53.29,29.09 53.32,29.06 v1(53.32,28.01) ; 53.29,29.09 55.73,29.09 ; 55.72,39.24 56.1,39.62 v1(56.1,40.39) ; 55.72,39.24 69.05,39.24 ; 81.3,9.02 81.26,8.99 v1(81.26,7.69) ; 81.3,9.02 82.4,9.02 82.66,9.28 v1(82.66,9.4) ; 81.3,9.02 69.07,9.02 ; v1(81.24,37.91) 81.24,39.21 81.28,39.24 ; 81.28,39.24 82.39,39.24 82.64,39.5 v1(82.64,39.62) ; 81.28,39.24 69.05,39.24 ; v1(85.98,32.39) 86.18,32.59 v1(91.19,32.59) ; v1(56.11,30.23) 56.11,29.47 55.73,29.09 ; 53.29,9.02 53.32,8.99 v1(53.32,7.95) ; 53.29,9.02 43.92,9.02 43.9,9.05 43.44,9.05 43.28,9.21 43.28,9.67 v1(42.91,10.04) ; 69.05,39.24 69.43,39.62 v1(69.43,40.39) ; v1(69.45,30.23) 69.45,29.47 69.07,29.09 ; 81.29,29.09 81.26,29.05 v1(81.26,27.76) ; 81.29,29.09 82.4,29.09 82.65,29.34 v1(82.65,29.47) ; 81.29,29.09 69.07,29.09 ; v1(53.32,17.98) 53.32,19.03 53.29,19.06 ; v1(82.65,19.44) 82.65,19.31 82.4,19.06 81.29,19.06 ; 81.29,19.06 81.26,19.02 v1(81.26,17.73) ; P1.4 6.1,68.32 6.44,68.66 6.55,68.66 6.73,68.83 6.73,69.03 7.87,70.17 v1(7.87,72.01) ; 69.07,29.09 55.73,29.09 ; v1(42.9,20.07) 43.28,19.7 43.28,19.24 43.44,19.08 43.89,19.08 43.92,19.06 53.29,19.06 ; v1(69.45,10.17) 69.45,9.4 69.07,9.02
  Inner1 w0.127: v1(85.22,61.4) 85.22,60.07 84.96,59.82 84.96,58.9 84.98,58.89 84.98,58.46 84.96,58.45 84.96,57.66 83.44,56.13 v1(83.44,55.98)
  Inner1 w0.2: v1(85.98,32.39) 81.24,37.12 v1(81.24,37.91) ; v1(14.73,26.67) 15.41,26.67 v1(20.03,22.05) ; v1(6.22,57.28) 6.22,59.78 6.35,59.91 6.35,60.75 6.22,60.87 6.22,61.34 6.35,61.47 6.35,62.31 6.37,62.33 6.37,63.17 5.78,63.77 4.94,63.77 v1(3.56,65.15) ; v1(39.75,47.62) 39.88,47.5 39.88,46.76 36.65,43.54 36.65,43.08 36.98,42.75 39.55,42.75 v1(39.88,42.42) ; v1(24.38,38.1) 23.36,37.08 v1(20.95,37.08) ; v1(81.26,27.76) 81.26,26.82 v1(85.85,22.23) 86.36,22.23 89.28,19.3 89.28,15.62 v1(91.06,13.84) 89.41,12.19 v1(85.98,12.19) ; v1(7.87,72.01) 7.75,71.88 v1(6.22,71.88)
  Inner1 w0.254: v1(7.87,72.01) 8.44,72.01 9.03,72.59 12.9,72.59 13.08,72.77 14.22,72.77 14.73,73.28 15.02,73.28 15.09,73.36 17.26,73.36 17.6,73.01 17.6,72.82 18.13,72.29 18.13,68.3 22.55,63.88 28.7,63.88 29.72,62.86 29.72,61.88 30.73,60.86 H2.1 ; v1(82.64,39.62) 83.44,40.42 v1(83.44,55.98)
  Inner2 w0.2: v1(24.33,22.05) 24.33,27.77 24.27,27.84 24.27,28.3 24.33,28.36 v1(24.33,30.48) ; v1(35.81,51.3) 35.81,49.78 v1(33.15,47.12) 24.38,38.35 v1(24.38,38.1) ; v1(20.03,22.05) 19.56,21.58 19.56,14.88 19.99,14.45 19.99,13.99 19.56,13.56 v1(19.56,13.08) ; v1(7.87,72.01) 8.13,71.76 8.74,71.76 9.04,71.45 13.96,71.45 14.69,72.19 17.25,72.19 17.68,71.76 v1(19.43,71.76)
  Bottom Layer w0.127: 85.18,65.79 83.7,65.79 R1.2 82.74,66.86 C49.2 82.93,68.9 82.93,69.34 82.46,69.81 80.35,69.81 80.26,69.72 80.26,69.62 R6.2 79.5,66.99 C5.1 ; 85.18,65.79 86.17,65.79 C50.2 87.19,66.81 C47.2 ; 85.18,65.79 85.22,65.75 v1(85.22,61.4) ; v1(85.22,61.4) 85.92,62.1 87,62.1 ; v1(85.22,61.4) U56.4
  Bottom Layer w0.2: RN13.7 RN13.6 RN13.5 ; RN13.7 39.57,42.36 39.62,42.42 v1(39.88,42.42) ; RN13.7 RN13.8 ; v1(24.33,22.05) v1(20.03,22.05) ; v1(85.85,22.23) 85.85,21.75 RN6.7 ; RN5.8 RN5.7 RN5.6 RN5.5 ; RN8.7 85.98,11.84 v1(85.98,12.19) ; RN8.7 RN8.8 ; RN8.7 RN8.6 RN8.5 ; v1(15.49,39.37) 17.73,37.13 SD1.4 ; 86.01,31.49 85.98,31.52 v1(85.98,32.39) ; 86.01,31.49 RN23.7 RN23.8 ; 86.01,31.49 RN23.6 RN23.5 ; RN20.5 RN20.6 RN20.7 RN20.8 ; RN17.8 RN17.7 RN17.6 RN17.5 ; RN15.8 RN15.7 RN15.6 RN15.5 ; U54.16 96.53,20.29 RN19.7 RN19.8 95.81,16.33 95.24,15.75 93.61,15.75 93.03,16.33 RN9.8 ; R5.1 R4.1 v1(24.38,38.1) ; C4.1 24.26,30.55 24.26,33.9 R2.1 ; v1(91.06,13.84) 91.96,14.74 RN9.8 ; v1(6.22,57.28) 6.72,56.78 6.72,54.36 6.86,54.21 7.06,54.21 7.28,54.44 7.28,55.86 7.22,55.93 ; RN21.8 RN21.7 RN21.6 RN21.5 ; RN7.5 RN7.6 RN7.7 RN7.8 ; 66.22,11.42 RN18.7 ; RN4.5 RN4.6 RN4.7 RN4.8 ; RN22.8 RN22.7 ; 91.96,18.73 RN9.7 RN9.8 ; RN3.8 RN3.7 RN3.6 RN3.5 ; RN6.7 RN6.6 RN6.5 ; RN6.7 RN6.8 ; RN16.8 RN16.7 ; RN14.8 RN14.7
  Bottom Layer w0.254: RN16.7 RN16.6 68.19,21.46 v1(69.45,20.2) ; RN20.5 41.52,31.49 v1(42.9,30.1) ; v1(97.04,45.67) 94.62,43.25 94.62,40.58 94.82,40.37 94.82,39.89 94.62,39.69 94.62,32.77 94.44,32.59 v1(91.19,32.59) ; v1(42.9,20.07) 41.52,21.46 RN15.5 ; RN13.5 41.5,41.65 v1(42.89,40.26) ; RN14.7 RN14.6 68.17,41.65 v1(69.43,40.39) ; RN18.7 68.19,11.42 v1(69.45,10.17) ; v1(69.45,30.23) 68.19,31.49 RN22.6 RN22.7 ; v1(82.66,9.4) 82.74,9.4 RN8.8 ; v1(56.11,10.17) 57.37,11.42 RN7.8 ; v1(82.64,39.62) 82.72,39.62 RN4.8 ; RN5.8 57.37,21.46 v1(56.11,20.2) ; RN3.8 57.36,41.65 v1(56.1,40.39) ; v1(56.11,30.23) 57.37,31.49 RN21.8 ; RN6.8 82.74,19.44 v1(82.65,19.44) ; RN17.5 41.52,11.42 v1(42.91,10.04) ; v1(82.65,29.47) 82.74,29.47 RN23.8
  vias: v1(91.96,17.11)
+5V: length 195
  Top Layer w0.2: v1(26.67,47.62) 26.61,47.56 C20.2 28.14,49.16 U9.6 28.14,49.51 27.76,49.89 27.5,49.89 27.35,50.04 27.35,50.3 27.18,50.47 27.18,50.67 27.35,50.85 27.35,51.73 27.58,51.95 L1.2 ; USB3.1 10.36,33.22 v1(10.41,33.27) ; v1(11.43,52.96) 10.51,52.96 USB2.1 7.54,52.53 v1(5.72,54.36) ; POWER/TTL.A9 7.16,13.6 6.8,13.6 6.22,14.17 6.22,16.67 6.65,17.1 6.65,17.75 6.9,18 POWER/TTL.B9 11.46,18 13.33,16.13 v1(15.62,16.13) 16.51,17.02 16.51,20.08 15.78,20.81 15.78,23.25 16.51,23.98 16.51,24 17.72,25.21 C2.2 17.72,29.17 v1(17.61,29.28) ; v1(15.49,42.93) 15.49,42.62 15.63,42.49 15.63,42.14 15.95,41.82 15.95,41.62 U8.12 15.81,40.52 15.85,40.48 15.85,40.03 v1(16.38,39.5) ; C22.1 31.94,12.32 C23.1 ; U4.7 18,14.22 v1(19.43,14.22) 20.33,15.13 24.24,15.13 24.38,14.99 24.38,11.82 C24.1
  Top Layer w0.254: C23.1 31.18,9.66 C24.1
  Inner1 w0.2: v1(16.38,39.5) 16.38,39.24 v1(10.41,33.27)
  Inner2 w0.2: v1(11.43,52.96) 15.49,48.9 v1(15.49,42.93) 15.78,43.21 15.78,43.97 16.1,44.3 16.86,44.3 20.19,47.62 v1(26.67,47.62)
  Inner2 w0.254: v1(92.07,45.67) 90.12,47.62 54.17,47.62 53.96,47.42 53.48,47.42 53.1,47.04 44.84,47.04 43.8,48.08 43.32,48.08 42.62,47.38 40.34,47.38 39.99,47.04 39.51,47.04 36.4,50.15 36.4,51.54 36.06,51.89 35.57,51.89 33.19,49.51 33.19,47.99 32.83,47.62 v1(26.67,47.62)
  Bottom Layer w0.2: v1(10.41,33.27) 10.8,32.89 12.45,32.89 16.06,29.28 v1(17.61,29.28) ; 5.22,55.93 5.22,54.36 5.36,54.21 5.57,54.21 v1(5.72,54.36) 5.72,55.92 5.72,55.93 ; v1(15.62,16.13) 17.53,14.22 v1(19.43,14.22)
GND: length 791.8
  Top Layer w0.127: U2.8 78.45,59.02 77.98,58.55 77.98,57.28 ; 77.98,57.28 78.34,56.92 U2.11 ; 77.98,57.28 77.98,56.01 78.47,55.52 U2.13 83.17,55.52 83.57,55.12 83.82,55.12 v1(84.2,55.5) ; v1(80.84,66.93) 82.17,66.93 83.95,68.71 v1(84.07,68.71)
  Top Layer w0.2: 96.27,16.51 96.27,26.26 96.7,26.69 96.7,27.15 96.27,27.58 96.27,27.59 ; 96.27,16.51 95.29,15.53 SW143.1 SW142.1 SW121.1 ; 96.27,16.51 96.27,7.53 SW145.1 SW144.1 SW137.1 ; U2.13 77.12,52.29 R97.1 77.44,44.72 78.12,45.41 79.13,45.41 83.4,41.15 85.42,41.15 85.56,41 85.56,39.44 83.48,37.36 81.01,37.36 80.69,37.68 80.53,37.68 80.21,37.36 79.34,37.36 SW102.1 ; POWER/TTL.A12 7.55,12.19 POWER/TTL.0 POWER/TTL.0 POWER/TTL.0 ; R24.1 32.1,50.19 32.56,50.66 32.63,50.66 32.78,50.81 32.78,50.88 v1(35.81,53.91) ; R24.1 31.5,50.41 U9.2 30.01,49.98 29.8,49.98 29.65,49.83 29.65,49.62 29.46,49.43 29.46,46.78 C19.1 28.72,45.21 27.31,45.21 26.54,45.97 C20.1 26.61,46.23 v1(26.67,46.23) ; R24.1 34.4,47.5 C31.2 ; POWER/TTL.B1 9.2,11.05 v1(9.27,11.05) ; 96.27,27.59 v1(96.27,28.2) 96.27,33.69 SW139.1 94.23,35.72 SW105.1 ; 96.27,27.59 96.15,27.48 95.91,27.48 95.58,27.15 95.58,26.91 SW141.1 SW140.1 ; USB3.7 8.28,36.71 USB3.5 ; P1.41 30.76,64.22 H1.1 ; U4.3 v1(20.95,13.72) ; 2G.1 57.15,53.6 57.27,53.6 57.94,52.93 57.94,51.72 57.83,51.61 57.83,51.43 57.62,51.21 56.49,51.21 56.33,51.05 54.28,51.05 U3.9 53.96,50.98 50.8,50.98 50.65,50.84 50.65,47.68 48.78,45.81 48.78,43.05 47.24,41.51 46.78,41.51 46.46,41.83 46,41.83 45.32,41.15 43.44,41.15 43.1,40.82 42.68,40.82 42.34,41.15 40.14,41.15 39.99,41 39.99,39.44 40.14,39.3 42.86,39.3 43.27,38.89 43.72,38.89 43.75,38.86 44.83,38.86 SW93.1 ; POWER/TTL.0 2.61,23.31 2.63,23.33 ; POWER/TTL.0 POWER/TTL.0 7.55,19.31 POWER/TTL.A1 POWER/TTL.B12 ; USB2.6 USB2.5 8.28,56.01 USB2.7 ; USB2.6 8.28,42.04 USB2.8 8.54,43.8 8.77,44.02 10.08,45.34 USB2.4 ; USB2.6 USB3.5 ; U8.14 14.54,43.81 X1.4 15.08,44.82 15.12,44.82 15.26,44.97 15.26,45 15.49,45.23 15.49,47.82 C44.1 12.11,46.72 X1.2 11.99,45.53 USB2.4 ; C23.2 33.34,12.32 C22.2 ; 2.63,23.33 2.79,23.5 ; 2.63,23.33 2.63,25.46 2.84,25.68 2.84,26.14 2.49,26.49 2.49,27.15 2.63,27.29 USB3.5 ; v1(19.94,30.35) 19.61,30.68 C1.1 16.32,29.38 C2.1 16.32,26.97 C3.2 13.81,26.22 10.17,26.22 ; SW122.1 37.64,5.21 29.02,5.21 28.26,4.44 v1(20.45,4.44) ; SW140.1 89.53,26.96 v1(89.53,31.24) ; SW140.1 SW161.1 ; USB3.6 8.28,22.74 USB3.8 10.03,23.97 10.03,26.08 10.17,26.22 ; v1(6.48,46.74) 8.87,46.74 USB2.4 ; 10.17,26.22 USB3.4
  Top Layer w0.254: 44.54,35.72 44.41,35.6 v1(44.41,32.7) ; 44.54,35.72 SW90.1 ; 44.54,35.72 SW98.1 72.41,35.72 ; 44.54,35.72 SW92.1 ; 14.61,73.03 14.61,71.51 14.3,71.2 13.5,71.2 11.17,68.88 11.17,67.31 ; 14.61,73.03 14.99,73.41 17.27,73.41 17.65,73.03 17.65,68.25 ; 14.61,73.03 9.02,73.03 8.64,72.64 ; v1(72.37,22.29) 72.37,25.51 72.42,25.56 ; P1.29 18.6,68.22 18.64,68.25 ; 72.42,15.53 SW117.1 SW118.1 SW119.1 SW120.1 SW121.1 ; 72.42,15.53 72.37,15.47 v1(72.37,12.26) ; 72.42,15.53 SW114.1 44.55,15.53 ; SW137.1 SW136.1 SW135.1 SW134.1 SW133.1 72.43,5.5 ; 7.13,68.25 7.1,68.22 P1.6 ; 7.13,68.25 6.61,68.25 6.6,68.25 P1.5 ; 7.13,68.25 7.13,68.86 8.64,70.36 8.64,72.64 ; v1(44.43,2.48) 44.43,5.38 44.55,5.5 ; 15.12,68.25 14.57,68.25 14.6,68.21 P1.21 ; 15.12,68.25 15.12,66.94 P1.22 ; 15.12,68.25 17.65,68.25 ; 5.6,68.25 5.6,68.47 7.37,70.24 7.37,71.69 7.29,71.77 7.29,72.25 7.63,72.59 7.7,72.59 7.87,72.77 8.51,72.77 8.64,72.64 ; 5.6,68.25 P1.3 ; 5.6,68.25 3.93,68.25 P1.42 ; 44.55,25.56 SW154.1 72.42,25.56 ; 44.55,25.56 SW146.1 ; 44.55,25.56 SW148.1 ; 44.55,25.56 44.43,25.44 v1(44.43,22.54) ; 44.55,15.53 44.43,15.41 v1(44.43,12.51) ; 44.55,15.53 SW106.1 ; 44.55,15.53 SW108.1 ; 89.41,35.81 89.41,42.41 90.27,43.27 90.54,43.27 91.25,42.56 92.29,42.56 93,43.27 R100.1 ; 72.43,5.5 SW130.1 44.55,5.5 ; 72.43,5.5 72.37,5.44 v1(72.37,2.22) ; C23.2 33.5,10.26 33.5,5.21 ; 72.42,25.56 SW157.1 SW158.1 SW159.1 SW160.1 SW161.1 ; 18.64,68.25 17.65,68.25 ; 18.64,68.25 18.85,68.46 18.85,72 19.37,72.52 20.95,72.52 21.92,71.55 21.92,68.25 ; SW122.1 44.55,5.5 ; 44.55,5.5 SW124.1 ; 21.92,68.25 24.77,68.25 P1.41 ; 21.92,68.25 22.1,68.07 P1.36 ; SW105.1 SW104.1 SW103.1 SW102.1 SW101.1 72.41,35.72 ; P1.13 10.6,68.22 10.57,68.25 11.07,68.25 11.1,68.22 P1.14 ; 72.41,35.72 72.35,35.66 v1(72.35,32.44)
  Inner1 w0.2: v1(35.81,53.91) 32.51,57.21 32.51,62.23 32.37,62.37 31.14,62.37 H1.1 ; v1(26.67,46.23) 25.47,45.03 v1(19.97,45.03) ; v1(26.54,13.46) 19.93,20.07 v1(14.86,20.07)
  Inner2 w0.2: v1(19.94,42.92) 18.56,42.92 18.01,42.37 15.26,42.37 14.94,42.7 14.94,43.48 v1(14.35,44.07)
  Bottom Layer w0.127: v1(84.07,68.71) 84.71,68.71 86.11,70.1 87.42,70.1 C47.1 88.59,66.81 C50.1 88.86,66.52 88.86,63.41 ; 88.86,63.41 88.86,62.74 ; 88.86,63.41 88.77,63.5 U56.1 ; 88.86,62.74 88.86,60.8 ; 88.86,62.74 88.77,62.65 87.15,62.65 U56.2 ; v1(84.2,55.5) 86.69,55.5 U56.12 87.04,55.75 88.52,55.75 88.86,56.1 88.86,60.07 ; 88.86,60.8 88.77,60.71 87,60.71 U56.5 ; 88.86,60.8 88.86,60.07 ; 88.86,60.07 88.77,59.98 87.01,59.98 U56.6
  Bottom Layer w0.2: v1(20.45,4.44) 19.43,5.46 19.43,5.98 ; v1(6.48,46.74) 6.97,47.23 U1.68 ; v1(6.48,46.74) 6.06,46.74 ; v1(6.48,46.74) 6.48,48.37 U1.70 ; 6.06,46.74 6.06,48.29 U1.72 ; 6.06,46.74 5.84,46.74 5.47,47.11 U1.74 ; v1(9.27,11.05) 9.58,11.05 ; 9.58,11.05 20.91,11.05 20.95,11.01 ; 9.58,11.05 U1.78 ; v1(14.86,20.07) 14.5,20.42 14.5,21.35 10.37,25.48 SD1.10 ; SD1.10 19.07,45.93 v1(19.97,45.03) 19.94,45 v1(19.94,42.92) ; v1(20.95,13.72) 20.95,11.01 ; 20.95,11.01 20.95,7.51 19.43,5.98 ; C4.2 20.07,30.48 19.97,30.38 SD1.10 ; v1(19.94,30.35) 19.94,31.16 19.92,31.18 19.92,33.68 19.69,33.91 19.69,34.11 20.51,34.93 SD1.6 ; 19.43,5.98 R10.2 ; U54.8 90.74,30.03 v1(89.53,31.24)
D+: length 20.6
  Top Layer w0.2: POWER/TTL.B6 7.65,15.1 8.31,15.1 8.46,15.24 8.46,15.75 8.31,15.9 7.65,15.9 POWER/TTL.A6 8.4,16 8.48,16.07 8.68,16.07 8.85,15.9 12.55,15.9 17.25,11.21 19.45,11.21 21.03,12.79 21.87,12.79 21.95,12.72 U4.1
D-: length 20.6
  Top Layer w0.2: POWER/TTL.A7 7.55,15.49 6.86,15.49 6.65,15.7 6.65,16.25 6.9,16.5 POWER/TTL.B7 8.4,16.5 8.48,16.42 8.82,16.42 8.99,16.26 12.7,16.26 17.4,11.56 19.3,11.56 20.89,13.14 21.87,13.14 21.95,13.22 U4.2
DRX: length 43.4
  Top Layer w0.2: v1(24.82,28.07) 24.16,28.07 22.1,26.01 19.03,26.01 16.13,23.1 16.13,20.95 17.14,19.94 18.14,19.94 18.18,19.99 18.65,19.99 18.69,19.94 19.17,19.94 R18.2
  Bottom Layer w0.2: v1(24.82,28.07) 24.82,29.15 25.38,29.71 25.38,35.43 26.79,36.83 26.79,43.64 23.47,46.96 U1.2
DRX_CH: length 4.9
  Top Layer w0.2: U4.9 17.77,13.22 17.68,13.31 17.14,13.31 16.38,14.07 16.38,15.74 R14.1
DTX: length 37.5
  Top Layer w0.2: R14.2 18.42,17.01 v1(18.42,19.43)
  Bottom Layer w0.2: v1(18.42,19.43) 18.42,23.24 18.48,23.31 18.48,24.78 18.63,24.93 20.1,24.93 25.02,29.84 25.02,32.09 25.03,32.1 25.03,34.32 25.02,34.33 25.02,35.56 26.44,36.98 26.44,43.5 22.97,46.97 U1.4
DTX_CH: length 7.4
  Top Layer w0.2: R18.1 20.11,16.76 19.3,15.95 17.09,15.95 16.73,15.59 16.73,14.22 17.24,13.72 U4.8
ESP_INT: length 39.3
  Top Layer w0.2: v1(49.53,50.04) 49.53,49.96 U3.21
  Bottom Layer w0.127: v1(49.53,50.04) 49.53,56.39 47.47,58.45 31.87,58.45 31.65,58.23 25.11,58.23 24.83,57.95 22.11,57.95 21.83,57.67 19.72,57.67 19.72,55.93
ESP_RST: length 28.6
  Top Layer w0.2: R21.2 37.58,62.36 37.7,62.23 38.01,62.23 U3.3 38.98,61.1 37.23,61.1 37.08,60.96 37.08,58.29 v1(36.07,57.28)
  Bottom Layer w0.127: v1(36.07,57.28) 36.07,57.78 35.76,58.1 31.91,58.1 31.77,57.95 25.23,57.95 24.95,57.67 22.23,57.67 21.94,57.38 20.3,57.38 20.3,56.26 20.22,56.18 20.22,55.93
HPCOM: length 105.2
  Top Layer w0.2: 4.27,7.52 4.24,7.49 v1(4.19,7.49) ; 4.27,7.52 CN1.1 ; 4.27,7.52 CN1.1 6.6,6.93 v1(6.6,5.59)
  Inner1 w0.2: v1(4.19,7.49) 3.68,8 3.68,11 3.76,11.07 3.76,11.78 3.68,11.85 3.68,19.65 4.42,20.38 4.42,40.87 9.98,46.43 10.01,46.43 10.34,46.76 10.34,47.22 9.91,47.65 v1(9.91,54.1)
  Bottom Layer w0.2: v1(6.6,5.59) 15.36,5.59 C21.1 17.78,3.18 29.34,3.18 30.35,4.19 30.35,17.53 29.21,18.67 SW162.3 ; 10.22,55.93 10.22,54.44 10.11,54.33 10.11,54.31 v1(9.91,54.1)
HPL: length 91.7
  Top Layer w0.2: 10.93,9.26 12.7,7.49 12.7,3.39 CN1.3 ; 10.93,9.26 v1(10.92,9.27) ; 10.93,9.26 CN1.3
  Inner1 w0.2: v1(3.05,26.92) 4.06,27.94 4.06,41.28 v1(9.78,46.99)
  Bottom Layer w0.2: 27.14,16.23 26.51,16.86 26.24,16.86 26.09,17.01 26.09,17.28 25.46,17.91 12.32,17.91 8.51,21.72 3.25,21.72 3.05,21.92 v1(3.05,26.92) 3.03,26.94 2.05,26.94 1.91,26.8 1.91,26.31 1.73,26.14 1.73,25.68 1.91,25.5 1.91,23.24 2.34,22.8 2.34,21.63 2.96,21.01 3.94,21.01 3.94,10.33 4.61,9.65 10.54,9.65 v1(10.92,9.27) ; v1(9.78,46.99) 9.97,47.18 U1.56
HPR: length 102.2
  Top Layer w0.2: CN1.2 7.49,9.24 v1(7.49,9.02) 7.49,1.68 CN1.2
  Inner1 w0.2: v1(2.29,25.91) 2.54,26.16 2.54,26.64 2.49,26.69 2.49,40.2 9.02,46.73 9.02,47.62 9.08,47.69 v1(9.08,54.1)
  Bottom Layer w0.2: 4.74,21.37 3.1,21.37 2.7,21.77 2.7,25.5 v1(2.29,25.91) ; 4.74,21.37 8.36,21.37 12.17,17.56 24.86,17.56 26.09,16.33 26.09,15.74 26.24,15.59 26.82,15.59 27.05,15.37 29.24,15.37 29.84,15.97 29.84,17.2 29.65,17.4 SW162.2 ; 4.74,21.37 4.74,11.15 5.86,10.03 10.95,10.03 11.48,9.5 11.48,9.48 11.68,9.27 11.68,9.07 10.11,7.49 8.76,7.49 7.49,8.76 v1(7.49,9.02) ; v1(9.08,54.1) 9.08,55.29 9.72,55.93
HSYNC: length 49.8
  Top Layer w0.254: P1.32 20.1,65.64 20.94,64.79 21.59,64.79 22.1,64.28 22.1,62.1 22.49,61.71 24.03,61.71 24.61,61.13 24.61,59.72 25.27,59.06 27.05,59.06 28.19,60.2 H2.2
  Bottom Layer w0.127: H2.2 27.22,59.35 24.65,59.35 24.37,59.07 21.49,59.07 21.21,58.79 19.06,58.79 18.23,57.95 11.85,57.95 11.26,57.36 8.72,57.36 8.46,57.1 8.46,52.59 8.73,52.32 12.63,52.32 15.47,49.48 U1.34
KEY_DATA: length 48.4
  Inner1 w0.2: v1(44.45,27.94) 44.45,28.32 45.09,28.96 45.09,29.81 45.11,29.84 45.11,30.3 45.09,30.33 45.09,39.98 45.1,39.99 45.1,40.45 45.09,40.47 45.09,42.42 46.23,43.56 v1(46.61,43.56)
  Bottom Layer w0.2: 21.72,55.93 21.72,53.85 22.34,53.23 23.94,53.23 24.26,53.55 25.7,53.55 32.96,46.29 43.58,46.29 46.31,43.56 v1(46.61,43.56) ; U57.9 44.43,27.96 v1(44.45,27.94)
LCD_CS: length 76.4
  Top Layer w0.127: v1(77.22,59.69) 80.32,59.69 U2.7
  Inner1 w0.127: v1(77.22,59.69) 82.42,59.69 83.44,58.67 v1(84.46,58.67)
  Bottom Layer w0.127: 16.72,55.93 16.76,55.97 16.76,57.28 17.14,57.66 18.33,57.66 19.18,58.51 21.41,58.51 21.69,58.79 24.49,58.79 24.77,59.07 31.31,59.07 32.18,59.94 76.96,59.94 v1(77.22,59.69) ; v1(84.46,58.67) 84.53,58.6 87,58.6
LCD_DC: length 73.9
  Top Layer w0.127: v1(75.31,58.55) v1(77.34,60.58) 77.88,61.12 U2.5
  Inner1 w0.127: v1(84.33,59.56) 82.94,59.56 82.54,59.97 80.37,59.97 80.26,60.07 77.85,60.07 v1(77.34,60.58) ; v1(46.99,57.53) v1(48.13,58.67)
  Bottom Layer w0.127: U56.7 87.07,59.38 86.96,59.49 85.86,59.49 85.78,59.56 v1(84.33,59.56) ; v1(75.31,58.55) 74.42,58.55 73.86,59.11 48.57,59.11 v1(48.13,58.67) ; v1(46.99,57.53) 46.64,57.88 37.81,57.88 36.7,56.77 36.3,56.77 36.28,56.76 35.85,56.76 35.84,56.77 35.81,56.77 35.06,57.53 25.47,57.53 25.33,57.39 22.66,57.39 22.23,56.97 21.02,56.97 20.72,56.67 20.72,55.93
LCD_RST: length 92.9
  Top Layer w0.127: U2.6 82.21,60.42 82.8,59.82 v1(82.8,56.5)
  Bottom Layer w0.127: 21.22,55.93 21.22,53.46 21.77,52.91 24.08,52.91 24.4,53.23 25.57,53.23 32.82,45.98 43.45,45.98 46.68,42.75 55.95,42.75 56.9,43.69 56.9,43.93 57.02,44.06 57.27,44.06 59.31,46.1 59.31,56.9 61.09,58.67 73.79,58.67 74.8,57.66 81.65,57.66 v1(82.8,56.5) U56.11
LCD_SCL: length 86.7
  Top Layer w0.127: v1(82.8,61.34) 82.33,61.81 U2.4
  Bottom Layer w0.127: R6.1 81.09,68.76 81.09,67.83 81.45,67.47 81.45,66.39 81.09,66.03 81.09,65.84 82.8,64.14 v1(82.8,61.34) ; 17.72,55.93 17.72,56.91 17.91,57.1 18.56,57.1 19.41,57.95 21.72,57.95 22,58.23 24.72,58.23 25,58.51 31.54,58.51 32.41,59.39 75.44,59.39 76.18,58.65 77.84,58.65 80.53,61.34 v1(82.8,61.34) ; U56.9 83.96,57.9 82.8,59.06 v1(82.8,61.34)
LCD_SDA: length 86
  Top Layer w0.127: 83.44,61.59 82.55,62.48 80.38,62.48 U2.3 80.32,62.48 v1(78.1,62.48) ; 83.44,61.59 v1(83.44,57.2) ; 83.44,61.59 84.19,62.35 v1(84.19,66.8)
  Bottom Layer w0.127: U56.10 v1(83.44,57.2) ; v1(78.1,62.48) 77.98,62.36 77.98,59.18 77.72,58.93 76.84,58.93 76.1,59.67 32.3,59.67 31.42,58.79 24.88,58.79 24.6,58.51 21.8,58.51 21.52,58.23 19.3,58.23 18.44,57.38 17.4,57.38 17.22,57.2 17.22,55.93
PC0_CLK: length 47.9
  Top Layer w0.2: R11.2 v1(53.72,48.01) 53.48,48.01 U3.22
  Inner1 w0.2: v1(42.93,43.56) 43.92,43.56 44.47,44.12 46.84,44.12 47.4,43.56 49.28,43.56 v1(53.72,48.01)
  Bottom Layer w0.2: v1(42.93,43.56) 42.51,43.98 42.49,43.98 42.35,44.12 42.35,44.53 42.27,44.61 32.26,44.61 25.32,51.54 18.62,51.54 16.47,49.39 U1.30
PC1_CS: length 43.8
  Top Layer w0.2: U3.20 47.61,48.66 v1(48.64,47.62)
  Inner1 w0.2: v1(48.64,47.62) 47.12,47.62 44.07,44.58 43.05,44.58 42.29,43.81 42.29,43.43 42.37,43.36 42.37,43.33 42.7,43 42.72,43 v1(43.05,42.67)
  Bottom Layer w0.2: v1(43.05,42.67) 43.05,42.98 43.03,43 42.7,43 42,43.7 42,44.04 41.78,44.25 32.07,44.25 26.54,49.78 24.13,49.78 22.73,51.18 18.86,51.18 16.97,49.28 U1.28
PC2_MISO: length 34.8
  Top Layer w0.2: v1(43.56,47.5) 43.56,49.84 U3.18
  Inner1 w0.2: v1(43.56,47.5) 41.4,47.5 v1(37.21,43.31)
  Bottom Layer w0.2: v1(37.21,43.31) 36.62,43.9 31.93,43.9 26.4,49.43 23.98,49.43 22.59,50.83 19.12,50.83 17.47,49.17 U1.26
PC3_MOSI: length 27.5
  Top Layer w0.2: R9.2 41.61,47.97 U3.17
  Inner1 w0.2: v1(41.66,49.78) 41.28,50.17 25.91,50.17 25.65,49.91 24.79,49.91 24.78,49.9 24.16,49.9 24.14,49.91 v1(19.05,49.91)
  Bottom Layer w0.2: v1(19.05,49.91) 18.92,49.78 18.58,49.78 18.05,49.26 18.05,48.46 U1.24
PD0: length 53.4
  Top Layer w0.254: H2.12 2.79,61.31 1.78,62.32 1.78,63.18 2.39,63.79 3.78,63.79 5.81,65.82 14.99,65.82 15.05,65.89 15.37,65.89 15.6,66.12 P1.23
  Bottom Layer w0.127: H2.12 0.64,58.17 0.64,43.94 1.52,43.05 7.75,43.05 8.89,44.2 8.89,49.4 9.02,49.53 10.34,49.53 10.47,49.4 U1.54
PD1: length 32.5
  Top Layer w0.127: v1(10.67,54.1) 10.67,57.02 10.12,57.57 10.12,58.33 10.03,58.42 7.15,58.42 6.23,59.35 4.93,59.35 4.36,59.92 4.36,61.22 H1.12
  Top Layer w0.254: H1.12 3.28,62.75 3.48,62.56 3.73,62.56 3.91,62.74 3.91,63.35 5.98,65.42 16,65.42 16.1,65.52 P1.24
  Bottom Layer w0.127: 10.72,55.93 10.67,55.88 v1(10.67,54.1)
PD2: length 55.1
  Top Layer w0.254: H2.11 5.33,61.31 4.32,62.32 4.32,63.18 6.15,65.01 16.5,65.01 16.6,65.12 P1.25
  Bottom Layer w0.127: H2.11 4.36,59.35 2.21,59.35 0.91,58.05 0.91,44.06 1.64,43.33 7.63,43.33 8.61,44.31 8.61,49.68 8.74,49.81 10.84,49.81 10.97,49.68 U1.52
PD3: length 29.4
  Top Layer w0.127: 5.43,62.69 6.6,61.51 6.6,59.46 7.37,58.7 10.15,58.7 11.18,57.67 11.18,54.36 v1(11.43,54.1)
  Top Layer w0.254: P1.26 17.1,65.05 16.66,64.61 7.71,64.61 6.45,63.35 6.45,62.87 6.27,62.69 5.43,62.69
  Bottom Layer w0.127: 11.22,55.93 11.22,54.31 v1(11.43,54.1)
PD4: length 56.2
  Top Layer w0.254: P1.27 17.53,66.84 17.53,64.9 16.83,64.2 7.88,64.2 6.86,63.18 6.86,62.32 7.87,61.31 H2.10
  Bottom Layer w0.127: H2.10 6.72,60.33 5.46,59.07 2.33,59.07 1.19,57.94 1.19,44.17 1.75,43.61 7.49,43.61 8.33,44.45 8.33,49.96 8.46,50.09 11.34,50.09 11.47,49.96 U1.50
PD5: length 25.6
  Top Layer w0.127: v1(12.19,54.1) 11.68,54.61 11.68,57.28 11.45,57.51 11.45,57.79 9.02,60.23 9.02,61.64 H1.10
  Top Layer w0.254: P1.28 18.1,64.9 17,63.79 8.93,63.79 7.9,62.76 H1.10
  Bottom Layer w0.127: 11.72,55.93 11.72,54.58 v1(12.19,54.1)
PD6: length 66.9
  Top Layer w0.254: v1(15.33,72.77) 15.33,71.66 14.47,70.8 13.67,70.8 11.6,68.73 P1.15
  Bottom Layer w0.127: U1.48 11.97,50.01 11.61,50.37 8.18,50.37 8.05,50.24 8.05,44.57 7.44,43.95 1.81,43.95 1.47,44.29 1.47,57.82 2.44,58.79 5.58,58.79 6.13,59.35 9.44,59.35 H2.9
  Bottom Layer w0.254: H2.9 9.22,61.52 9.22,63.32 9.4,63.5 9.71,63.5 10.01,63.79 11.4,63.79 12.43,64.82 13.46,64.82 14.76,66.12 14.76,72.2 v1(15.33,72.77)
PD7: length 30
  Top Layer w0.127: H1.9 12.06,61.13 12.06,60.82 11.98,60.73 11.98,59.92 12.06,59.83 12.06,57.54 v1(12.2,57.4)
  Top Layer w0.254: v1(17.02,72.77) 15.39,71.14 15.39,70.57 15.21,70.39 13.83,70.39 12.1,68.66 P1.16
  Bottom Layer w0.127: v1(12.2,57.4) 12.2,55.94 12.22,55.93
  Bottom Layer w0.254: H1.9 10.93,62.75 12.59,64.41 13.75,64.41 15.17,65.83 15.17,70.92 v1(17.02,72.77)
PD8: length 66.6
  Top Layer w0.254: v1(17.02,71.63) 15.27,69.88 13.89,69.88 12.6,68.59 P1.17
  Bottom Layer w0.127: 12.35,48.39 12.47,48.51 12.47,50.01 11.83,50.65 7.9,50.65 7.77,50.52 7.77,44.74 7.28,44.24 1.92,44.24 1.75,44.4 1.75,57.69 2.57,58.51 5.69,58.51 6.25,59.07 9.55,59.07 9.83,59.35 10.82,59.35 11.8,60.33 H2.8
  Bottom Layer w0.254: v1(17.02,71.63) 15.57,70.18 15.57,65.35 14.83,64.61 14.75,64.61 14.15,64.01 12.76,64.01 11.94,63.18 11.94,63.12 11.81,62.99 11.81,62.74 11.94,62.61 11.94,62.32 12.55,61.71 12.84,61.71 12.95,61.59 H2.8
PD9: length 24.4
  Top Layer w0.127: H1.8 13.97,61.76 13.97,58.29 v1(13.08,57.4)
  Top Layer w0.254: P1.18 13.1,68.51 14.06,69.47 15.75,69.47 16.43,70.16 16.43,70.22 16.78,70.56 16.84,70.56 v1(17.02,70.74)
  Bottom Layer w0.127: v1(13.08,57.4) 12.72,57.04 12.72,55.93
  Bottom Layer w0.254: H1.8 13.67,62.75 14.07,63.16 14.07,63.35 14.92,64.2 15.11,64.2 15.98,65.06 15.98,69.7 16.43,70.16 16.43,70.22 16.78,70.56 16.84,70.56 v1(17.02,70.74)
PD10: length 63.4
  Top Layer w0.254: P1.19 13.6,68.44 14.23,69.06 16.1,69.06 v1(17.02,69.98)
  Bottom Layer w0.127: H2.7 14.34,60.33 13.36,59.35 11.21,59.35 10.66,58.79 6.52,58.79 5.96,58.23 2.71,58.23 2.03,57.56 2.03,44.71 2.22,44.52 7.16,44.52 7.5,44.85 7.5,50.74 7.68,50.92 12.05,50.92 12.97,50.01 U1.44
  Bottom Layer w0.254: H2.7 15.49,61.31 14.48,62.32 14.48,63.18 15.09,63.79 15.28,63.79 16.38,64.9 16.38,69.34 v1(17.02,69.98)
PD11: length 20.3
  Top Layer w0.127: H1.7 16.64,61.64 16.64,60.07 v1(13.97,57.4)
  Top Layer w0.254: P1.20 14.1,68.36 14.4,68.66 16.59,68.66 v1(17.02,69.09)
  Bottom Layer w0.127: 13.22,55.93 13.22,56.65 13.34,56.77 13.34,56.79 13.46,56.92 13.48,56.92 v1(13.97,57.4)
  Bottom Layer w0.254: v1(17.02,69.09) 17.02,64.25 H1.7
PD12: length 60.2
  Top Layer w0.254: v1(9.27,72.01) 9.27,71.12 9.49,70.9 9.49,70.64 7.6,68.75 P1.7
  Inner1 w0.254: v1(9.27,72.01) 9.27,71.95 17.02,64.2 17.02,62.32 17.2,62.15 17.2,61.16 H2.6
  Bottom Layer w0.127: H2.6 17.27,59.56 16.75,59.56 16.25,59.07 11.39,59.07 10.79,58.47 6.59,58.47 6.07,57.95 2.82,57.95 2.31,57.44 2.31,50.04 2.82,49.53 6.52,49.53 7.22,50.22 7.22,50.86 7.56,51.2 12.17,51.2 13.56,49.81 13.56,48.47 U1.42
PD13: length 33.8
  Top Layer w0.127: v1(12.95,54.1) 13.75,54.9 13.75,56.68 13.84,56.77 14.07,56.77 16.65,59.35 18.44,59.35 19.01,59.92 19.01,60.03 19.05,60.07 19.05,61.76 H1.6
  Top Layer w0.254: P1.8 8.1,68.1 8.2,68.2 8.2,68.77 10.03,70.61 v1(10.03,72.01)
  Inner1 w0.254: H1.6 18.06,64.68 12.54,70.2 11.84,70.2 v1(10.03,72.01)
  Bottom Layer w0.127: v1(12.95,54.1) 13.72,54.87 13.72,55.93
PD14: length 50.2
  Top Layer w0.254: P1.9 8.6,68.6 10.96,70.96 v1(10.96,72.01)
  Inner1 w0.254: H2.5 19.54,61.36 19.54,63.77 12.26,71.06 11.91,71.06 v1(10.96,72.01)
  Bottom Layer w0.127: H2.5 19.42,60.33 17.88,58.79 11.51,58.79 10.91,58.19 8.37,58.19 7.62,57.44 7.62,52.07 8.21,51.48 12.28,51.48 13.97,49.8 U1.40
PD15: length 33.8
  Top Layer w0.127: v1(13.72,54.1) 13.72,54.47 14.03,54.79 14.03,56.34 16.77,59.07 18.56,59.07 19.56,60.07 19.56,60.96 20.6,62 H1.5
  Top Layer w0.254: v1(11.88,72.01) 11.88,71.31 9.2,68.62 9.2,67.81 9.1,67.71 P1.10
  Inner1 w0.254: H1.5 20.6,63.53 13.47,70.66 13.23,70.66 v1(11.88,72.01)
  Bottom Layer w0.127: v1(13.72,54.1) 13.72,54.47 14.22,54.97 14.22,55.93
PD16: length 53.5
  Top Layer w0.254: v1(12.86,72.01) 12.86,71.72 9.6,68.46 P1.11
  Inner1 w0.254: v1(12.86,72.01) 14.23,70.64 14.64,70.64 16.03,69.25 16.03,68.68 20.16,64.55 20.73,64.55 22.06,63.21 22.06,61.37 H2.4
  Bottom Layer w0.127: U1.38 14.47,49.69 12.4,51.76 8.32,51.76 7.9,52.19 7.9,57.33 8.48,57.91 11.03,57.91 11.62,58.51 18,58.51 18.83,59.35 20.98,59.35 21.96,60.33 H2.4
PD17: length 35.4
  Top Layer w0.254: P1.12 10.1,68.38 v1(13.79,72.07)
  Inner1 w0.127: H1.4 24.09,61.8 24.09,59.92 23.52,59.35 23.24,59.35 22.44,58.55 16.76,58.55 15.88,57.66 v1(15.88,57.4)
  Inner1 w0.254: H1.4 23.1,62.75 17.35,68.5 16.78,68.5 16.43,68.85 16.43,69.42 v1(13.79,72.07)
  Bottom Layer w0.127: v1(15.88,57.4) 14.86,57.4 14.72,57.26 14.72,55.93
PD18: length 44.7
  Top Layer w0.254: v1(21.21,61.59) 21.69,62.08 21.69,64.05 21.35,64.39 20.78,64.39 19.1,66.06 P1.30
  Inner2 w0.254: H2.3 24.38,61.59 v1(21.21,61.59)
  Bottom Layer w0.127: 25.23,60.33 24.27,59.36 23.53,59.36 23.52,59.35 21.37,59.35 21.09,59.07 18.95,59.07 18.11,58.23 11.74,58.23 11.14,57.64 8.6,57.64 8.18,57.21 8.18,52.3 8.35,52.3 8.61,52.04 12.51,52.04 14.97,49.59 U1.36
  Bottom Layer w0.254: H2.3 25.23,60.33
PD19: length 28.2
  Top Layer w0.254: P1.34 21.1,65.79 21.28,65.61 22.83,65.61 H1.3
  Inner1 w0.127: v1(14.61,54.1) 15.15,54.65 15.15,56.81 15.24,56.9 15.65,56.9 15.66,56.88 16.12,56.88 17.5,58.27 25.25,58.27 26.67,59.69 26.67,61.09 25.68,62.08 H1.3
  Bottom Layer w0.127: v1(14.61,54.1) 14.61,54.57 15.1,55.06 15.1,55.81 15.22,55.93
PD21: length 32
  Top Layer w0.254: H1.2 27.15,62.75 26.11,61.71 25.25,61.71 24.64,62.32 24.64,63.22 22.66,65.2 21.11,65.2 20.6,65.71 P1.33
  Inner1 w0.127: v1(15.62,54.1) 15.62,56.48 15.75,56.6 16.23,56.6 17.41,57.78 17.91,57.78 18.11,57.99 25.36,57.99 26.95,59.57 26.95,60.98 28.22,62.26 H1.2
  Bottom Layer w0.127: v1(15.62,54.1) 15.62,55.83 15.72,55.93
PE9: length 236.1
  Top Layer w0.254: v1(53.32,2.48) 53.32,3.16 54.21,4.04 70.94,4.04 71.33,3.66 71.33,1.86 71.96,1.23 72.78,1.23 73.42,1.87 73.42,3.53 73.81,3.92 78.97,3.92 79.48,3.41 79.48,2.61 79.41,2.53 79.41,2.05 79.48,1.97 79.48,1.91 79.99,1.4 80.5,1.4 v1(81.26,2.16) ; v1(53.32,12.51) 53.32,13.19 54.21,14.08 70.94,14.08 71.33,13.69 71.33,11.9 71.96,11.27 72.78,11.27 73.42,11.91 73.42,13.56 73.81,13.95 78.97,13.95 79.48,13.44 79.48,12.64 79.4,12.57 79.4,12.08 79.48,12.01 79.48,11.94 79.99,11.44 80.5,11.44 v1(81.26,12.2) ; v1(81.26,22.23) 80.5,21.47 79.99,21.47 79.48,21.98 79.48,22.04 79.4,22.12 79.4,22.6 79.48,22.67 79.48,23.48 78.97,23.98 73.81,23.98 73.42,23.59 73.42,21.94 72.78,21.3 71.96,21.3 71.33,21.93 71.33,23.72 70.94,24.11 54.21,24.11 53.32,23.22 v1(53.32,22.54) ; v1(81.24,32.39) 80.48,31.62 79.97,31.62 79.47,32.13 79.47,32.19 79.39,32.27 79.39,32.75 79.47,32.83 79.47,33.63 78.96,34.14 73.79,34.14 73.4,33.75 73.4,32.09 72.76,31.45 71.94,31.45 71.31,32.08 71.31,33.88 70.92,34.27 54.19,34.27 53.3,33.38 v1(53.3,32.7)
  Inner1 w0.2: v1(50.16,41.78) 51.17,40.78 51.5,40.78 51.83,40.45 51.83,40.12 52.45,39.5 52.45,39.37 52.59,39.23 53.03,39.23 53.86,38.4 53.86,38.34 53.97,38.23 53.97,33.37 v1(53.3,32.7) 53.3,29.25 53.85,28.7 53.85,28.27 53.87,28.24 53.87,27.78 53.85,27.76 53.85,23.07 v1(53.32,22.54) 54.23,21.63 54.23,20.47 54.03,20.27 54.03,19.81 54.23,19.61 54.23,13.42 v1(53.32,12.51) 53.97,11.85 53.97,3.13 v1(53.32,2.48)
  Bottom Layer w0.2: v1(50.16,41.78) 47.2,41.78 43.32,45.66 32.69,45.66 25.44,52.92 24.54,52.92 24.22,52.6 20.41,52.6 19.22,53.79 19.22,55.93 ; U54.1 90.03,21.33 89.62,21.33 87.73,23.21 87.73,23.76 87.59,23.91 87.44,23.91 87.35,24 82.97,24 U58.1
PE10: length 234.6
  Top Layer w0.254: v1(52.03,32.7) 52.03,33.4 53.3,34.67 71.21,34.67 71.72,34.16 71.72,32.25 72.11,31.86 72.6,31.86 72.94,32.2 72.94,32.33 72.99,32.39 72.99,33.91 73.62,34.54 79.47,34.54 79.97,34.04 v1(79.97,32.51) ; v1(52.05,2.48) 52.05,3.18 53.32,4.45 71.23,4.45 71.74,3.94 71.74,2.03 72.13,1.64 72.61,1.64 72.95,1.98 72.95,2.11 73,2.16 73,3.69 73.64,4.32 79.48,4.32 79.99,3.82 v1(79.99,2.29) ; v1(79.99,12.32) 79.99,13.85 79.48,14.36 73.64,14.36 73,13.72 73,12.2 72.95,12.15 72.95,12.01 72.61,11.67 72.13,11.67 71.73,12.06 71.73,13.98 71.22,14.48 53.32,14.48 52.05,13.21 v1(52.05,12.51) ; v1(79.99,22.36) 79.99,23.88 79.48,24.39 73.64,24.39 73,23.75 73,22.23 72.95,22.18 72.95,22.05 72.61,21.7 72.13,21.7 71.73,22.1 71.73,24.01 71.22,24.52 53.32,24.52 52.05,23.25 v1(52.05,22.54)
  Inner1 w0.2: v1(52.05,2.48) 52.71,3.14 52.71,7.75 52.73,7.78 52.73,8.24 52.71,8.26 52.71,13.17 ; 52.71,13.17 52.71,17.79 52.73,17.81 52.73,18.27 52.71,18.29 52.71,21.88 v1(52.05,22.54) 52.71,23.2 52.71,27.81 ; 52.71,13.17 v1(52.05,12.51) ; 52.71,27.81 52.73,27.84 52.73,32 v1(52.03,32.7) 52.72,33.38 52.72,38.46 52.39,38.78 51.92,38.78 50.72,39.99 50.72,40.36 49.8,41.28 v1(46.23,41.28)
  Inner2 w0.2: v1(88.5,23.24) 80.87,23.24 v1(79.99,22.36)
  Bottom Layer w0.2: v1(46.23,41.28) 46.23,41.65 44.88,42.99 44.88,43.41 44.55,43.74 44.14,43.74 42.56,45.31 32.55,45.31 25.61,52.24 20.24,52.24 18.72,53.77 18.72,55.93 ; v1(88.5,23.24) 88.65,23.1 88.65,22.99 89.44,22.99 89.83,22.6 90.03,22.6 U54.2
  Bottom Layer w0.254: v1(79.99,2.29) U53.2 ; v1(79.99,12.32) 79.99,12.26 ; v1(79.97,32.51) U49.2 ; v1(79.99,22.36) U58.2
